# Altium project WK_核心底板_v1_20250228.PrjPcb (part 1 of 2)
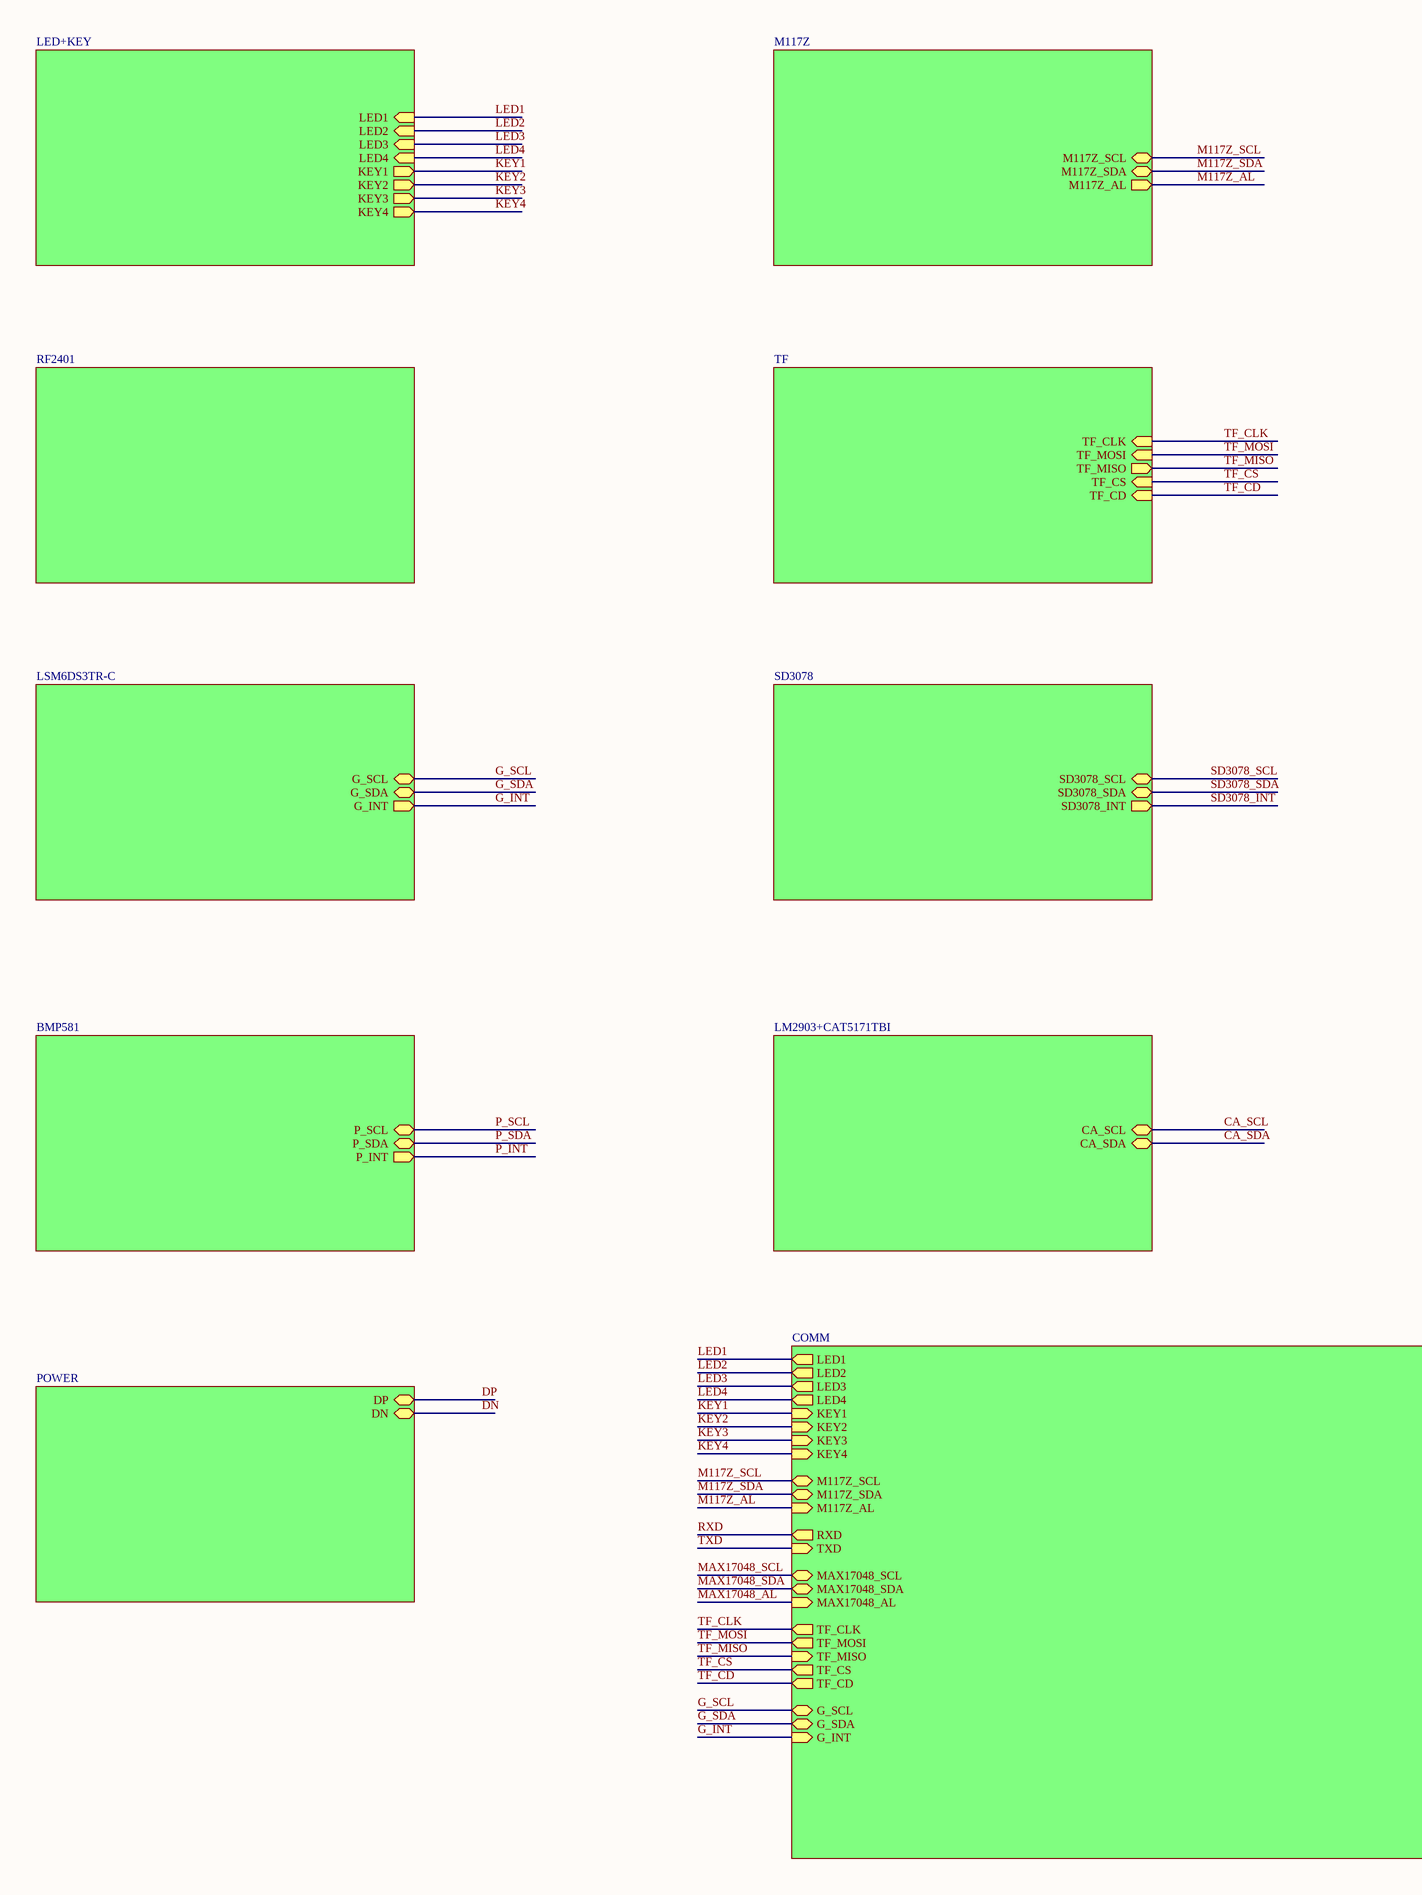
[diagram p0: COVER.SchDoc, left]
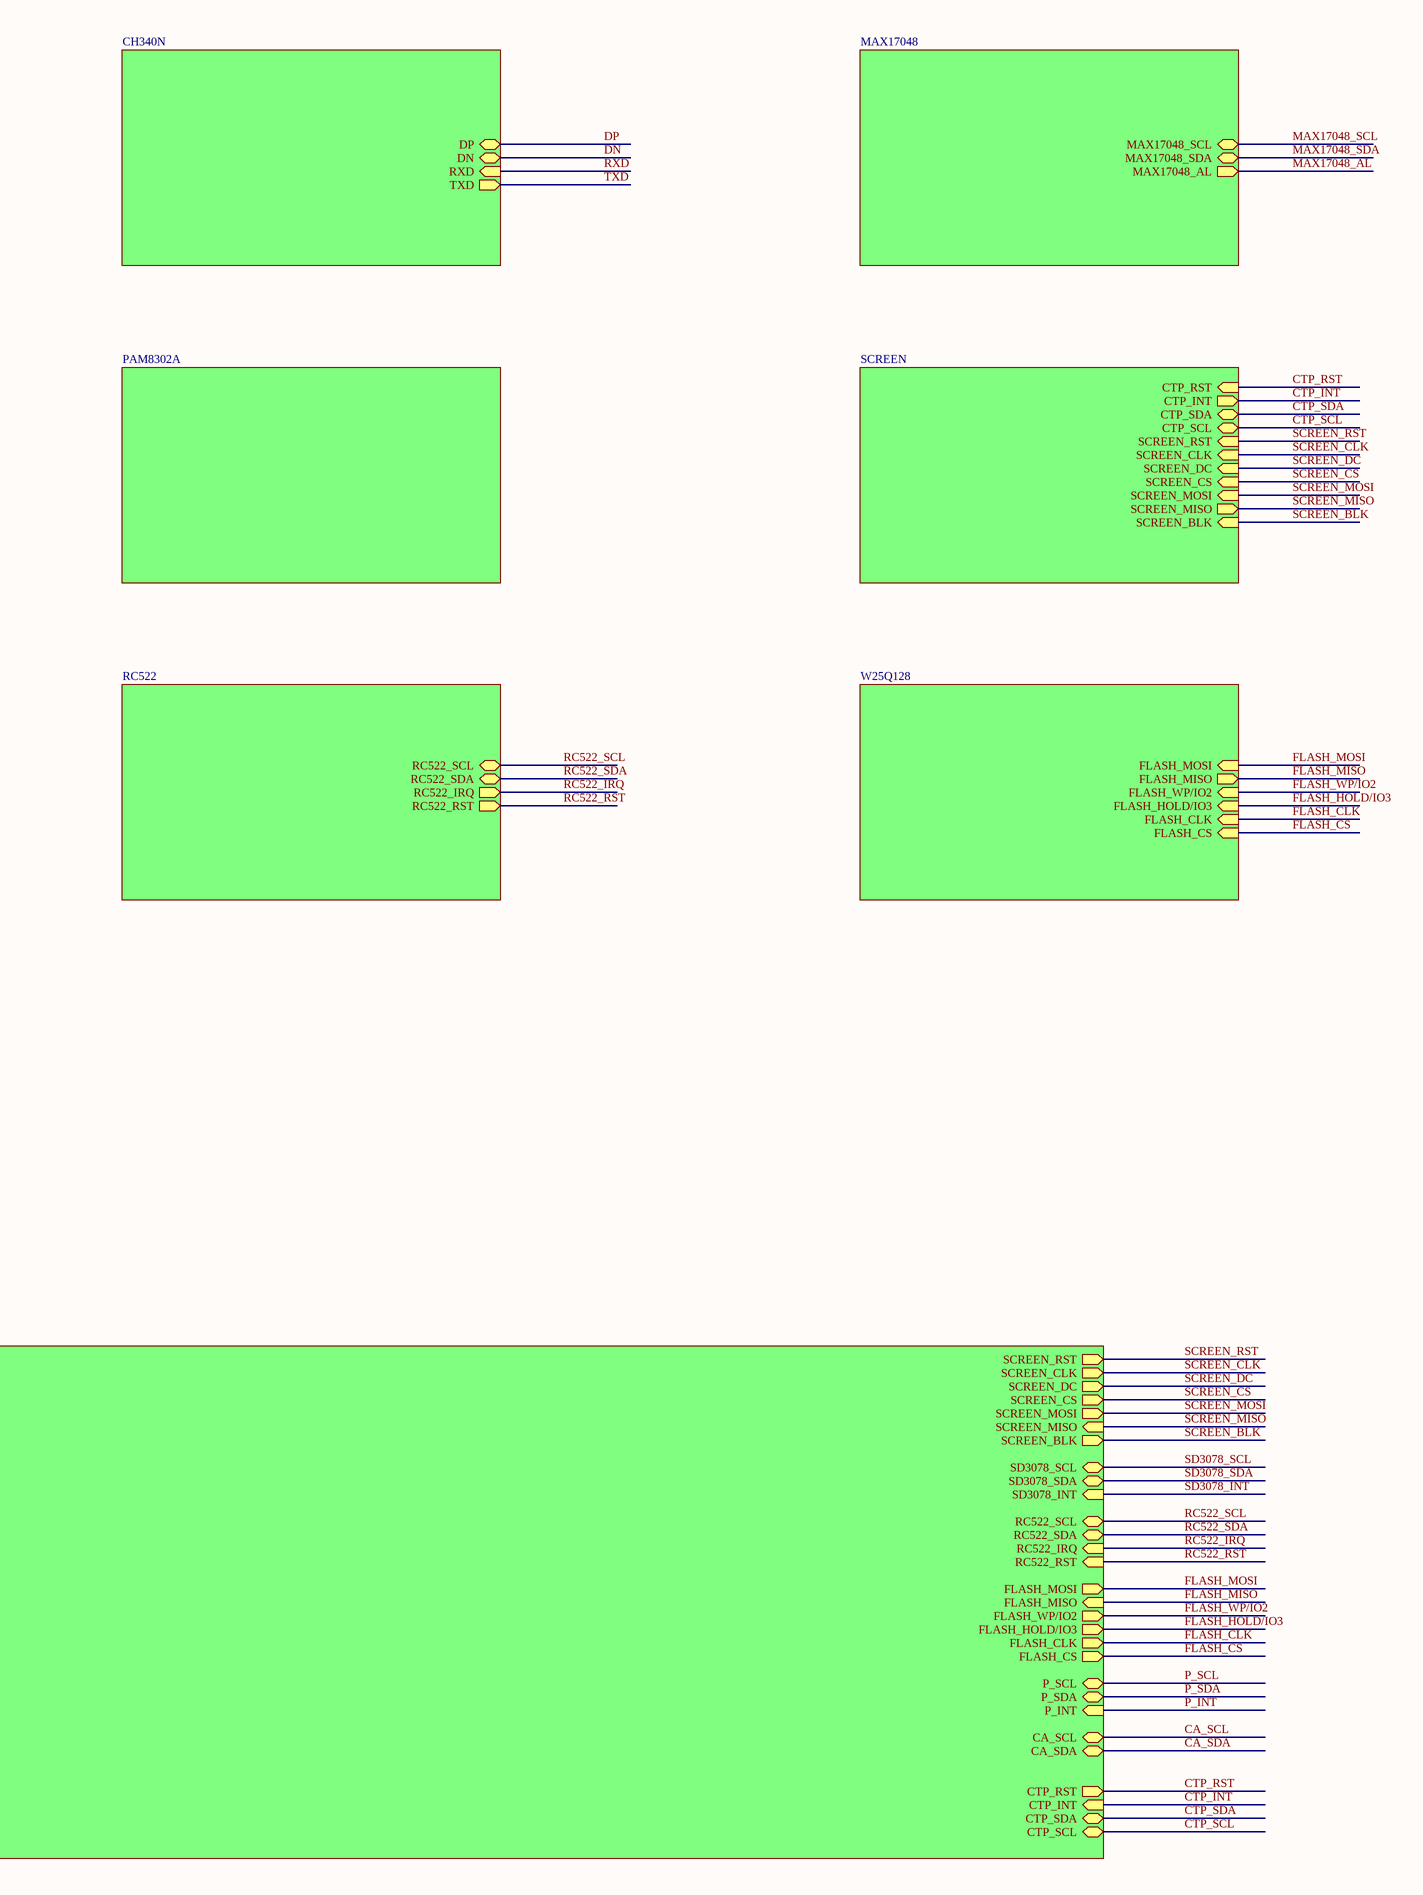
[diagram p1: COVER.SchDoc, right]
17 sheets, 291 parts. Net scope: hierarchical (ports join the sheet entries above them; power ports are global).
Board file: WK_TEST_V01_20250304.PcbDoc
Sheets:
  COVER.SchDoc
    LED+KEY = LED+KEY.SchDoc
    M117Z = M117Z.SchDoc
    CH340N = CH340N.SchDoc
    MAX17048 = MAX17048.SchDoc
    W25Q128 = W25Q128.SchDoc
    RF2401 = RF2401.SchDoc
    TF = TF.SchDoc
    PAM8302A = PAM8302A.SchDoc
    SCREEN = SCREEN.SchDoc
    BMP581 = BMP581.SchDoc
    LSM6DS3TR-C = LSM6DS3TR-C.SchDoc
    SD3078 = SD3078.SchDoc
    RC522 = RC522.SchDoc
    COMM = COMM.SchDoc
    POWER = POWER.SchDoc
    LM2903+CAT5171TBI = LM2903+CAT5171TBI.SchDoc

## Sheet COVER.SchDoc
size A2; SheetNumber: 1; SheetTotal: 17

### Sub-sheets
BMP581 = BMP581: P_SCL (bidir), P_SDA (bidir), P_INT (out)
CH340N = CH340N: DP (bidir), DN (bidir), RXD (in), TXD (out)
COMM = COMM: LED1 (out), LED2 (out), LED3 (out), LED4 (out), KEY1 (in), KEY2 (in), KEY3 (in), KEY4 (in), M117Z_SCL (bidir), M117Z_SDA (bidir), M117Z_AL (in), RXD (out), TXD (in), MAX17048_SCL (bidir), MAX17048_SDA (bidir), MAX17048_AL (in), TF_CLK (out), TF_MOSI (out), TF_MISO (in), TF_CS (out), TF_CD (out), SCREEN_RST (out), SCREEN_CLK (out), SCREEN_DC (out), SCREEN_CS (out), SCREEN_MOSI (out), SCREEN_MISO (in), SCREEN_BLK (out), G_SCL (bidir), G_SDA (bidir), G_INT (in), SD3078_SCL (bidir), SD3078_SDA (bidir), SD3078_INT (in), RC522_SCL (bidir), RC522_SDA (bidir), RC522_IRQ (in), RC522_RST (in), FLASH_MOSI (out), FLASH_MISO (in), FLASH_WP/IO2 (out), FLASH_HOLD/IO3 (out), FLASH_CLK (out), FLASH_CS (out), P_SCL (bidir), P_SDA (bidir), P_INT (in), CA_SCL (bidir), CA_SDA (bidir), CTP_RST (out), CTP_INT (in), CTP_SDA (bidir), CTP_SCL (bidir)
LED+KEY = LED+KEY: LED1 (in), LED2 (in), LED3 (in), LED4 (in), KEY1 (out), KEY2 (out), KEY3 (out), KEY4 (out)
LM2903+CAT5171TBI = LM2903+CAT5171TBI: CA_SCL (bidir), CA_SDA (bidir)
LSM6DS3TR-C = LSM6DS3TR-C: G_SCL (bidir), G_SDA (bidir), G_INT (out)
M117Z = M117Z: M117Z_SCL (bidir), M117Z_SDA (bidir), M117Z_AL (out)
MAX17048 = MAX17048: MAX17048_SCL (bidir), MAX17048_SDA (bidir), MAX17048_AL (out)
PAM8302A = PAM8302A: no entries
POWER = POWER: DP (bidir), DN (bidir)
RC522 = RC522: RC522_SCL (bidir), RC522_SDA (bidir), RC522_IRQ (out), RC522_RST (out)
RF2401 = RF2401: no entries
SCREEN = SCREEN: SCREEN_RST (in), SCREEN_CLK (in), SCREEN_DC (in), SCREEN_CS (in), SCREEN_MOSI (in), SCREEN_MISO (out), SCREEN_BLK (in), CTP_RST (in), CTP_INT (out), CTP_SDA (bidir), CTP_SCL (bidir)
SD3078 = SD3078: SD3078_SCL (bidir), SD3078_SDA (bidir), SD3078_INT (out)
TF = TF: TF_CLK (in), TF_MOSI (in), TF_MISO (out), TF_CS (in), TF_CD (in)
W25Q128 = W25Q128: FLASH_MOSI (in), FLASH_MISO (out), FLASH_WP/IO2 (in), FLASH_HOLD/IO3 (in), FLASH_CLK (in), FLASH_CS (in)

### Nets
CA_SCL: sheet COMM/CA_SCL, sheet LM2903+CAT5171TBI/CA_SCL
CA_SDA: sheet COMM/CA_SDA, sheet LM2903+CAT5171TBI/CA_SDA
CTP_INT: sheet SCREEN/CTP_INT, sheet COMM/CTP_INT
CTP_RST: sheet SCREEN/CTP_RST, sheet COMM/CTP_RST
CTP_SCL: sheet SCREEN/CTP_SCL, sheet COMM/CTP_SCL
CTP_SDA: sheet SCREEN/CTP_SDA, sheet COMM/CTP_SDA
DN: sheet CH340N/DN, sheet POWER/DN
DP: sheet CH340N/DP, sheet POWER/DP
FLASH_CLK: sheet W25Q128/FLASH_CLK, sheet COMM/FLASH_CLK
FLASH_CS: sheet W25Q128/FLASH_CS, sheet COMM/FLASH_CS
FLASH_HOLD/IO3: sheet W25Q128/FLASH_HOLD/IO3, sheet COMM/FLASH_HOLD/IO3
FLASH_MISO: sheet W25Q128/FLASH_MISO, sheet COMM/FLASH_MISO
FLASH_MOSI: sheet W25Q128/FLASH_MOSI, sheet COMM/FLASH_MOSI
FLASH_WP/IO2: sheet W25Q128/FLASH_WP/IO2, sheet COMM/FLASH_WP/IO2
G_INT: sheet LSM6DS3TR-C/G_INT, sheet COMM/G_INT
G_SCL: sheet LSM6DS3TR-C/G_SCL, sheet COMM/G_SCL
G_SDA: sheet LSM6DS3TR-C/G_SDA, sheet COMM/G_SDA
KEY1: sheet LED+KEY/KEY1, sheet COMM/KEY1
KEY2: sheet LED+KEY/KEY2, sheet COMM/KEY2
KEY3: sheet LED+KEY/KEY3, sheet COMM/KEY3
KEY4: sheet LED+KEY/KEY4, sheet COMM/KEY4
LED1: sheet LED+KEY/LED1, sheet COMM/LED1
LED2: sheet LED+KEY/LED2, sheet COMM/LED2
LED3: sheet LED+KEY/LED3, sheet COMM/LED3
LED4: sheet LED+KEY/LED4, sheet COMM/LED4
M117Z_AL: sheet M117Z/M117Z_AL, sheet COMM/M117Z_AL
M117Z_SCL: sheet M117Z/M117Z_SCL, sheet COMM/M117Z_SCL
M117Z_SDA: sheet M117Z/M117Z_SDA, sheet COMM/M117Z_SDA
MAX17048_AL: sheet MAX17048/MAX17048_AL, sheet COMM/MAX17048_AL
MAX17048_SCL: sheet MAX17048/MAX17048_SCL, sheet COMM/MAX17048_SCL
MAX17048_SDA: sheet MAX17048/MAX17048_SDA, sheet COMM/MAX17048_SDA
P_INT: sheet BMP581/P_INT, sheet COMM/P_INT
P_SCL: sheet BMP581/P_SCL, sheet COMM/P_SCL
P_SDA: sheet BMP581/P_SDA, sheet COMM/P_SDA
RC522_IRQ: sheet RC522/RC522_IRQ, sheet COMM/RC522_IRQ
RC522_RST: sheet RC522/RC522_RST, sheet COMM/RC522_RST
RC522_SCL: sheet RC522/RC522_SCL, sheet COMM/RC522_SCL
RC522_SDA: sheet RC522/RC522_SDA, sheet COMM/RC522_SDA
RXD: sheet CH340N/RXD, sheet COMM/RXD
SCREEN_BLK: sheet SCREEN/SCREEN_BLK, sheet COMM/SCREEN_BLK
SCREEN_CLK: sheet SCREEN/SCREEN_CLK, sheet COMM/SCREEN_CLK
SCREEN_CS: sheet SCREEN/SCREEN_CS, sheet COMM/SCREEN_CS
SCREEN_DC: sheet SCREEN/SCREEN_DC, sheet COMM/SCREEN_DC
SCREEN_MISO: sheet SCREEN/SCREEN_MISO, sheet COMM/SCREEN_MISO
SCREEN_MOSI: sheet SCREEN/SCREEN_MOSI, sheet COMM/SCREEN_MOSI
SCREEN_RST: sheet SCREEN/SCREEN_RST, sheet COMM/SCREEN_RST
SD3078_INT: sheet SD3078/SD3078_INT, sheet COMM/SD3078_INT
SD3078_SCL: sheet SD3078/SD3078_SCL, sheet COMM/SD3078_SCL
SD3078_SDA: sheet SD3078/SD3078_SDA, sheet COMM/SD3078_SDA
TF_CD: sheet TF/TF_CD, sheet COMM/TF_CD
TF_CLK: sheet TF/TF_CLK, sheet COMM/TF_CLK
TF_CS: sheet TF/TF_CS, sheet COMM/TF_CS
TF_MISO: sheet TF/TF_MISO, sheet COMM/TF_MISO
TF_MOSI: sheet TF/TF_MOSI, sheet COMM/TF_MOSI
TXD: sheet CH340N/TXD, sheet COMM/TXD

## Sheet LED+KEY.SchDoc
size A4; SheetNumber: 2; SheetTotal: 17
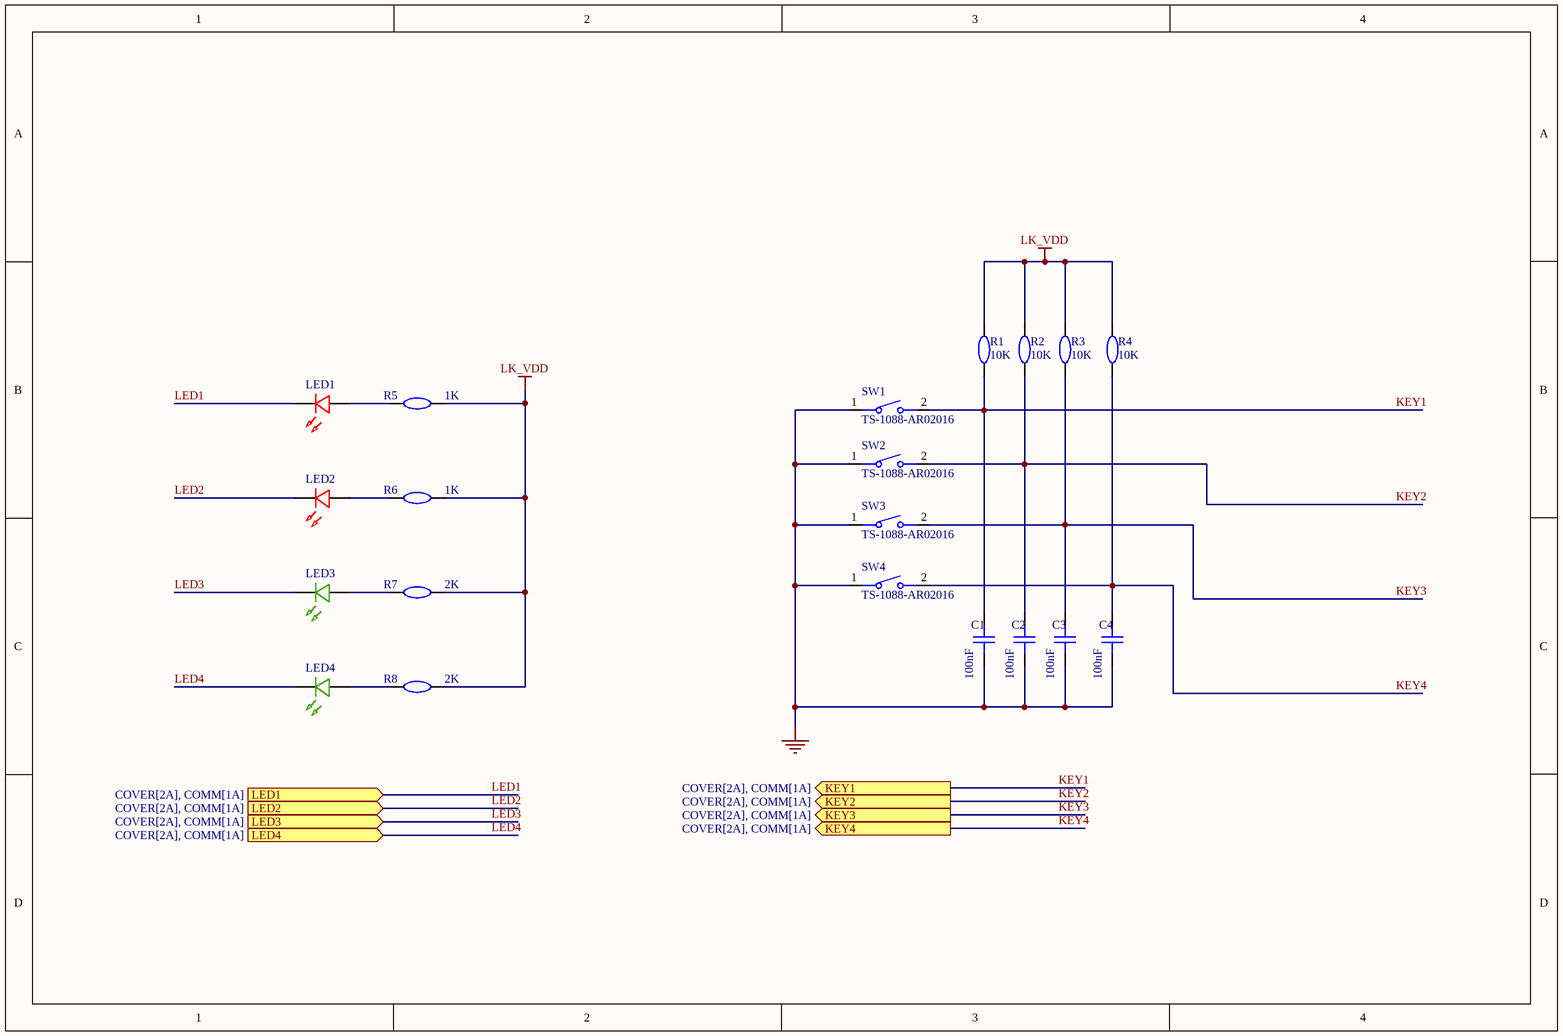
[diagram p2: LED+KEY.SchDoc]

### Parts
C1  100nF  [C0402]
C2  100nF  [C0402]
C3  100nF  [C0402]
C4  100nF  [C0402]
LED1  LED_0603-R  [LED_0603]  (value not drawn)
LED2  LED_0603-R  [LED_0603]  (value not drawn)
LED3  LED_0603-R  [LED_0603]  (value not drawn)
LED4  LED_0603-R  [LED_0603]  (value not drawn)
R1  10K  [R0402]
R2  10K  [R0402]
R3  10K  [R0402]
R4  10K  [R0402]
R5  1K  [R0402]
R6  1K  [R0402]
R7  2K  [R0402]
R8  2K  [R0402]
SW1  TS-1088-AR02016  [SW-SMD_L3.9-W3.0-P4.45]
SW2  TS-1088-AR02016  [SW-SMD_L3.9-W3.0-P4.45]
SW3  TS-1088-AR02016  [SW-SMD_L3.9-W3.0-P4.45]
SW4  TS-1088-AR02016  [SW-SMD_L3.9-W3.0-P4.45]

### Ports
KEY1 (out, see COVER[2A], COMM[1A]), KEY2 (out, see COVER[2A], COMM[1A]), KEY3 (out, see COVER[2A], COMM[1A]), KEY4 (out, see COVER[2A], COMM[1A]), LED1 (in, see COVER[2A], COMM[1A]), LED2 (in, see COVER[2A], COMM[1A]), LED3 (in, see COVER[2A], COMM[1A]), LED4 (in, see COVER[2A], COMM[1A])

### Nets
GND: C1.1 C2.1 C3.1 C4.1 SW1.1 SW2.1 SW3.1 SW4.1
LK_VDD: R1.2 R2.2 R3.2 R4.2 R5.1 R6.1 R7.1 R8.1
KEY1: C1.2 R1.1 SW1.2 ; port KEY1
KEY2: C2.2 R2.1 SW2.2 ; port KEY2
KEY3: C3.2 R3.1 SW3.2 ; port KEY3
KEY4: C4.2 R4.1 SW4.2 ; port KEY4
LED1: LED1.1(C) ; port LED1
LED2: LED2.1(C) ; port LED2
LED3: LED3.1(C) ; port LED3
LED4: LED4.1(C) ; port LED4
NetLED1_2: LED1.2(A) R5.2
NetLED2_2: LED2.2(A) R6.2
NetLED3_2: LED3.2(A) R7.2
NetLED4_2: LED4.2(A) R8.2

### Library data of the parts
C1-C4 = CAP_0402: Symbol: CapAcitance; Device: CAP_0603; Convert to PCB: yes; Add into BOM: yes; Supplier Footprint: 0603; Value: 100nF; Name: 100nF
LED1 LED2 = LED_0603-R: Symbol: LED_R; Convert to PCB: yes; Device: LED_0603-R; Add into BOM: yes; Supplier Footprint: 0603
LED3 LED4 = LED_0603-G: Symbol: LED_R; Convert to PCB: yes; Device: LED_0603-R; Add into BOM: yes; Supplier Footprint: 0603
R1-R8 = Res_0402: Symbol: 电阻; Device: Res_0603; Convert to PCB: yes; Add into BOM: yes; Supplier Footprint: 0603
  R1-R4: Value: 10K; Name: 10K
  R5 R6: Value: 1K; Name: 1K
  R7 R8: Value: 2K; Name: 2K
SW1-SW4 = TS-1088-AR02016: Manufacturer: XUNPU(讯普); Add into BOM: yes; Circuit: 单刀单掷; Actuator Style: 圆形按钮; Operating Force: 160gf; Switch Length: 4mm; Switch Width: 3mm; Switch Height: 2mm; Strike Gundam: 不带; Contact Current: 50mA; Voltage Rating (DC): 12V; Insulation Resistance: 100MΩ; Actuator/Cap Color: 黑色; Pin Style: SMD接片; Mechanical Life: 10万次; Symbol: TS-1088-AR02016; Device: TS-1088-AR02016; LCSC Part Name: 4*3*2mm 立贴 轻触开关; Supplier Part: C720477; Manufacturer Part: TS-1088-AR02016; Supplier Footprint: SMD; Datasheet: https://atta.szlcsc.com/upload/public/pdf/source/20200810/C720475_60D09DD6C54279ADDB2DC25100F1CC11.pdf; Supplier: LCSC; Convert to PCB: yes; Mounting Style: 立贴; Operating Temperature: -30℃~+80℃; Name: TS-1088-AR02016

## Sheet M117Z.SchDoc
size A4; SheetNumber: 3; SheetTotal: 17
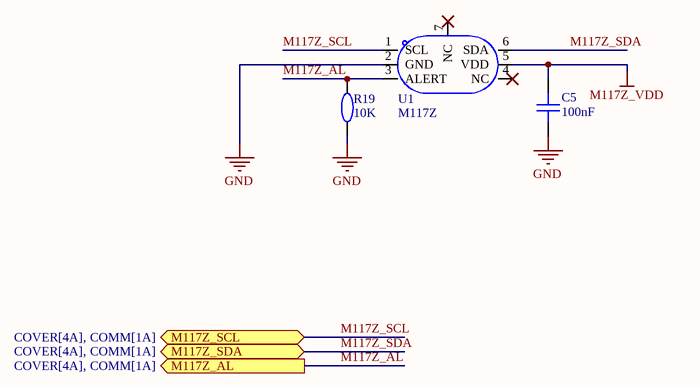
[diagram p3: M117Z.SchDoc]

### Parts
C5  100nF  [C0402]
R19  10K  [R0402]
U1  M117Z  [TDFN-6_L2.0-W2.0-P0.65-TL-EP1.4]

### Ports
M117Z_AL (out, see COVER[4A], COMM[1A]), M117Z_SCL (bidir, see COVER[4A], COMM[1A]), M117Z_SDA (bidir, see COVER[4A], COMM[1A])

### Nets
GND: C5.1 R19.1 U1.2(GND)
M117Z_VDD: C5.2 U1.5(VDD)
M117Z_AL: R19.2 U1.3(ALERT) ; port M117Z_AL
M117Z_SCL: U1.1(SCL) ; port M117Z_SCL
M117Z_SDA: U1.6(SDA) ; port M117Z_SDA

Not connected (* = marked no-connect by the designer): U1 4(NC)* 7(NC)*

### Library data of the parts
C5 = CAP_0402: as C1 on sheet LED+KEY; Add into BOM: yes; Supplier Footprint: 0603; Value: 100nF; Name: 100nF
R19 = Res_0402: as R1 on sheet LED+KEY; Add into BOM: yes; Supplier Footprint: 0603; Value: 10K; Name: 10K
U1 = M117Z: Manufacturer: Mysentech(敏源传感); Add into BOM: yes; Tolerance: ±0.1℃; Voltage - Supply: 1.8V~5.5V; Standby Current: 100nA; Interface: I2C; Symbol: M117Z; Device: M117Z; LCSC Part Name: 0.1℃ I2C数字温度传感器; Supplier Part: C3010933; Manufacturer Part: M117Z; Supplier Footprint: TDFN-6-EP(2x2); Datasheet: https://atta.szlcsc.com/upload/public/pdf/source/20210825/E4930D3FBCA70456AA9027E524284463.pdf; Supplier: LCSC; Convert to PCB: yes; Temperature Range: -70℃~+150℃; Name: M117Z

## Sheet CH340N.SchDoc
size A4; SheetNumber: 4; SheetTotal: 17
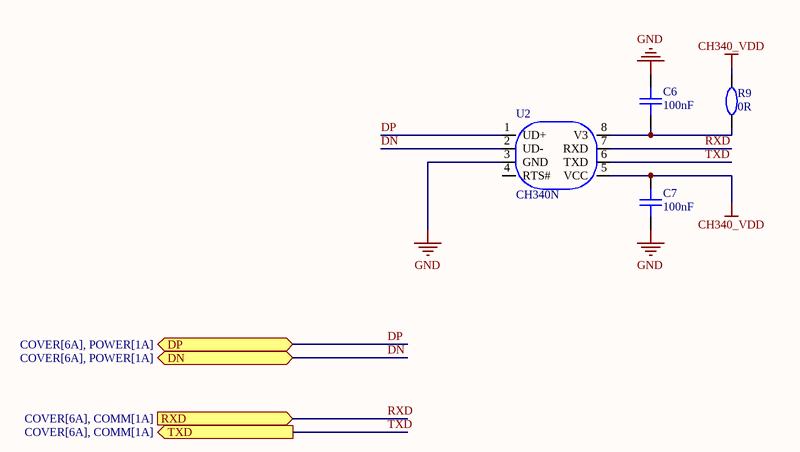
[diagram p4: CH340N.SchDoc]

### Parts
C6  100nF  [C0402]
C7  100nF  [C0402]
R9  0R  [R0402]
U2  CH340N  [SOP-8_L4.9-W3.9-P1.27-LS6.0-BL]

### Ports
DN (bidir, see COVER[6A], POWER[1A]), DP (bidir, see COVER[6A], POWER[1A]), RXD (in, see COVER[6A], COMM[1A]), TXD (out, see COVER[6A], COMM[1A])

### Nets
CH340_VDD: C7.2 R9.2 U2.5(VCC)
GND: C6.2 C7.1 U2.3(GND)
DN: U2.2(UD-) ; port DN
DP: U2.1(UD+) ; port DP
RXD: U2.7(RXD) ; port RXD
TXD: U2.6(TXD) ; port TXD
NetC6_1: C6.1 R9.1 U2.8(V3)

Not connected (* = marked no-connect by the designer): U2 4(RTS#)

### Library data of the parts
C6 C7 = CAP_0402: as C1 on sheet LED+KEY; Add into BOM: yes; Supplier Footprint: 0603; Value: 100nF; Name: 100nF
R9 = Res_0402: as R1 on sheet LED+KEY; Add into BOM: yes; Supplier Footprint: 0603; Value: 0R; Name: 0R
U2 = CH340N: Manufacturer: WCH(南京沁恒); Symbol: CH340N_C2977777; Add into BOM: yes; Applications Function: USB转串口; Protocol: USB 2.0; Number of Channels: 1; Voltage - Supply: 3.3V；5V; Data Rate: 2Mbps; Device: CH340N; LCSC Part Name: USB2.0芯片CH340; Supplier Part: C2977777; Manufacturer Part: CH340N; Supplier Footprint: SOP-8; Datasheet: https://atta.szlcsc.com/upload/public/pdf/source/20240313/115CDE92081B1D6CB446704AD5D0F5F2.pdf; Supplier: LCSC; Convert to PCB: yes; Operating Temperature: -20℃~+70℃; Name: CH340N

## Sheet MAX17048.SchDoc
size A4; SheetNumber: 5; SheetTotal: 17
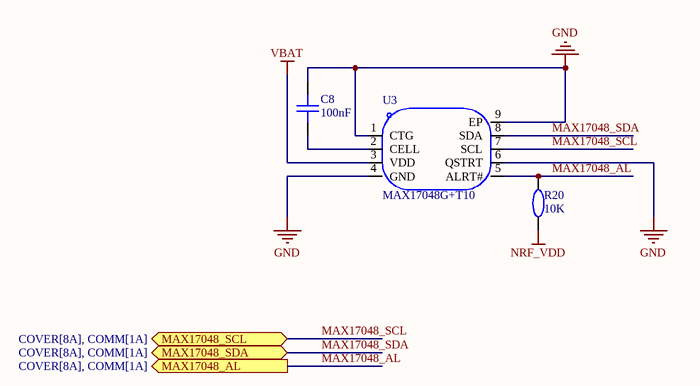
[diagram p5: MAX17048.SchDoc]

### Parts
C8  100nF  [C0402]
R20  10K  [R0402]
U3  MAX17048G+T10  [DFN-8_L2.0-W2.0-P0.50-BL-EP]

### Ports
MAX17048_AL (out, see COVER[8A], COMM[1A]), MAX17048_SCL (bidir, see COVER[8A], COMM[1A]), MAX17048_SDA (bidir, see COVER[8A], COMM[1A])

### Nets
GND: C8.2 U3.1(CTG) U3.4(GND) U3.6(QSTRT) U3.9(EP)
NRF_VDD: R20.1
VBAT: U3.3(VDD)
MAX17048_AL: R20.2 U3.5(ALRT#) ; port MAX17048_AL
MAX17048_SCL: U3.7(SCL) ; port MAX17048_SCL
MAX17048_SDA: U3.8(SDA) ; port MAX17048_SDA
NetC8_1: C8.1 U3.2(CELL)

### Library data of the parts
C8 = CAP_0402: as C1 on sheet LED+KEY; Add into BOM: yes; Supplier Footprint: 0603; Value: 100nF; Name: 100nF
R20 = Res_0402: as R1 on sheet LED+KEY; Add into BOM: yes; Supplier Footprint: 0603; Value: 10K; Name: 10K
U3 = MAX17048G+T10: Manufacturer: ADI(亚德诺)/MAXIM(美信); Add into BOM: yes; The Chip Type: 电池监测芯片; Type of Battery: 锂离子/聚合物; Number of Cells: 1; Symbol: MAX17048G+T10; Device: MAX17048G+T10; LCSC Part Name: MAX17048G+T10; Supplier Part: C2682616; Manufacturer Part: MAX17048G+T10; Supplier Footprint: DFN-8-EP(2x2); Datasheet: https://atta.szlcsc.com/upload/public/pdf/source/20210106/C2682616_818568B5D3BA4B627110FCAA33E0BFB1.pdf; Supplier: LCSC; Convert to PCB: yes; Operating Temperature: -20℃~+70℃; Name: MAX17048G+T10

## Sheet W25Q128.SchDoc
size A4; SheetNumber: 6; SheetTotal: 17
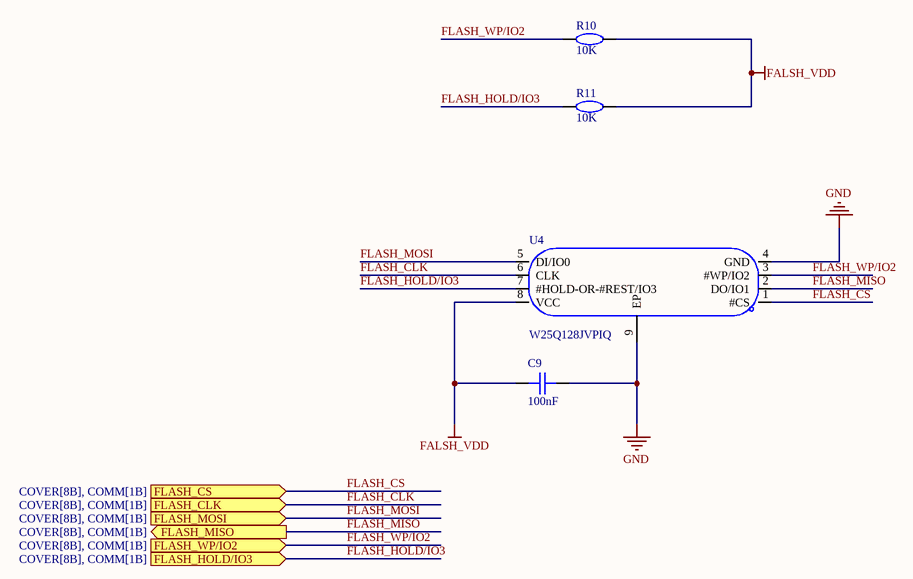
[diagram p6: W25Q128.SchDoc]

### Parts
C9  100nF  [C0402]
R10  10K  [R0402]
R11  10K  [R0402]
U4  W25Q128JVPIQ  [WSON-8_L6.0-W5.0-P1.27-BL-EP]

### Ports
FLASH_CLK (in, see COVER[8B], COMM[1B]), FLASH_CS (in, see COVER[8B], COMM[1B]), FLASH_HOLD/IO3 (in, see COVER[8B], COMM[1B]), FLASH_MISO (out, see COVER[8B], COMM[1B]), FLASH_MOSI (in, see COVER[8B], COMM[1B]), FLASH_WP/IO2 (in, see COVER[8B], COMM[1B])

### Nets
FALSH_VDD: C9.1 R10.2 R11.2 U4.8(VCC)
GND: C9.2 U4.4(GND) U4.9(EP)
FLASH_CLK: U4.6(CLK) ; port FLASH_CLK
FLASH_CS: U4.1(#CS) ; port FLASH_CS
FLASH_HOLD/IO3: R11.1 U4.7(#HOLD-OR-#REST/IO3) ; port FLASH_HOLD/IO3
FLASH_MISO: U4.2(DO/IO1) ; port FLASH_MISO
FLASH_MOSI: U4.5(DI/IO0) ; port FLASH_MOSI
FLASH_WP/IO2: R10.1 U4.3(#WP/IO2) ; port FLASH_WP/IO2

### Library data of the parts
C9 = CAP_0402: as C1 on sheet LED+KEY; Add into BOM: yes; Supplier Footprint: 0603; Value: 100nF; Name: 100nF
R10 R11 = Res_0402: as R1 on sheet LED+KEY; Add into BOM: yes; Supplier Footprint: 0603; Value: 10K; Name: 10K
U4 = W25Q128JVPIQ_C190862: Manufacturer: WINBOND(华邦); Symbol: W25Q128JVPIQTR; Add into BOM: yes; Memory Size: 128Mbit; Device: W25Q128JVPIQ_C190862; LCSC Part Name: W25Q128JVPIQ; Supplier Part: C190862; Manufacturer Part: W25Q128JVPIQ; Supplier Footprint: WSON-8-EP(5x6); Datasheet: https://atta.szlcsc.com/upload/public/pdf/source/20190705/C401662_06B6D416F67ED315879B366F63A3F7C9.pdf; Supplier: LCSC; Convert to PCB: yes; Name: W25Q128JVPIQ

## Sheet RF2401.SchDoc
size A3; SheetNumber: 7; SheetTotal: 17
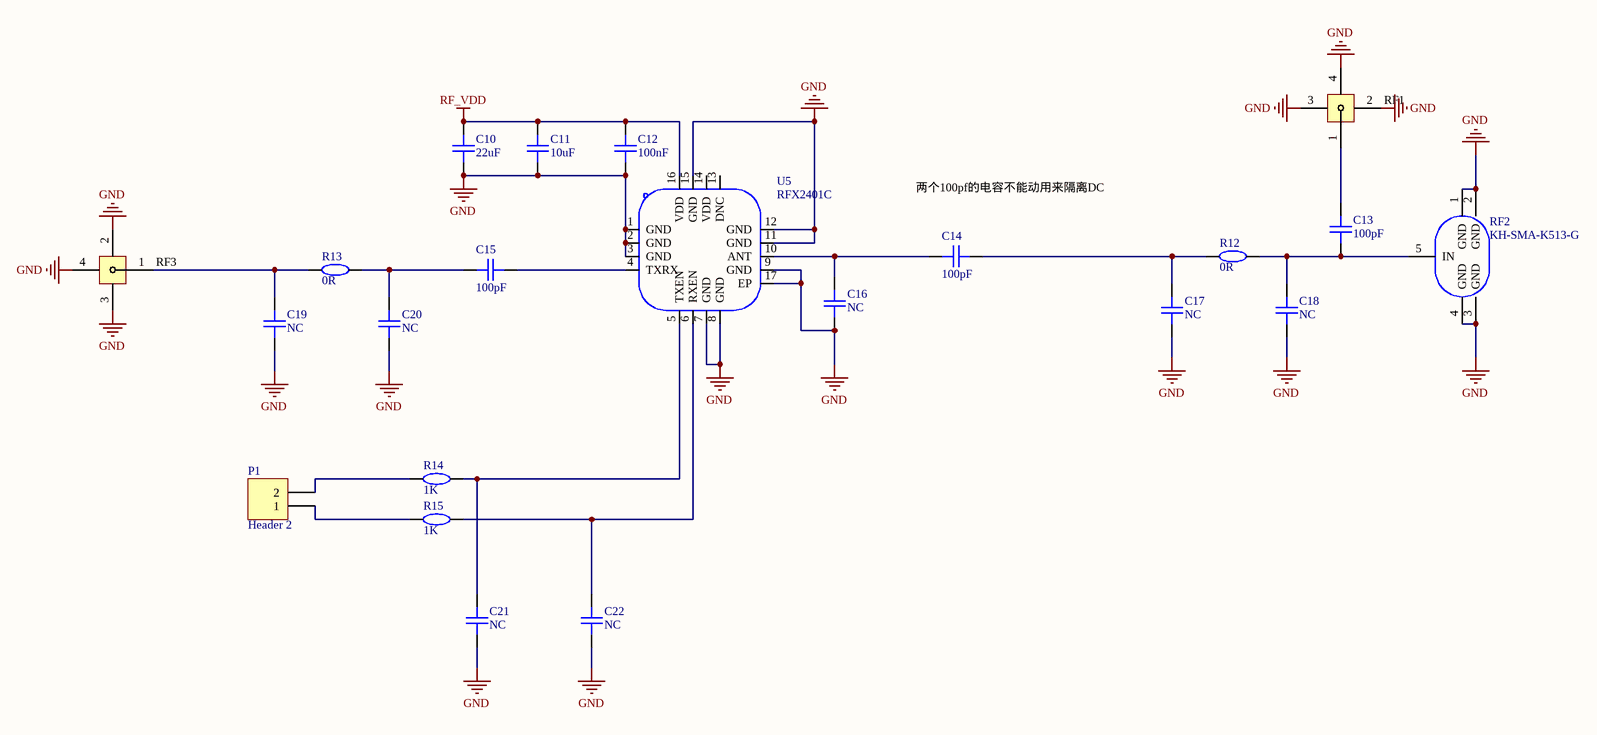
[diagram p7: RF2401.SchDoc]

### Parts
C10  22uF  [C0603]
C11  10uF  [C0603]
C12  100nF  [C0402]
C13  100pF  [C0402]
C14  100pF  [C0402]
C15  100pF  [C0402]
C16  NC  [C0402]
C17  NC  [C0402]
C18  NC  [C0402]
C19  NC  [C0402]
C20  NC  [C0402]
C21  NC  [C0402]
C22  NC  [C0402]
P1  Header 2  [HDR1X2]
R12  0R  [R0402]
R13  0R  [R0402]
R14  1K  [R0402]
R15  1K  [R0402]
RF1  BWIPX-4-001E  [IPEX-SMD_BWIPX-4-001E]  (value not drawn)
RF2  KH-SMA-K513-G  [ANT-TH_KH-SMA-K513-G]
RF3  BWIPX-4-001E  [IPEX-SMD_BWIPX-4-001E]  (value not drawn)
U5  RFX2401C  [QFN-16_L3.0-W3.0-P0.50-BL-EP1.7]

### Nets
GND: C10.1 C11.1 C12.1 C16.2 C17.2 C18.2 C19.2 C20.2 C21.2 C22.2 RF1.2 RF1.3 RF1.4 RF2.1(GND) RF2.2(GND) RF2.3(GND) RF2.4(GND) RF3.2 RF3.3 RF3.4 U5.1(GND) U5.2(GND) U5.3(GND) U5.7(GND) U5.8(GND) U5.9(GND) U5.11(GND) U5.12(GND) U5.15(GND) U5.17(EP)
RF_VDD: C10.2 C11.2 C12.2 U5.16(VDD)
NetC13_1: C13.1 RF1.1
NetC13_2: C13.2 C18.1 R12.2 RF2.5(IN)
NetC14_1: C14.1 C17.1 R12.1
NetC14_2: C14.2 C16.1 U5.10(ANT)
NetC15_1: C15.1 U5.4(TXRX)
NetC15_2: C15.2 C20.1 R13.2
NetC19_1: C19.1 R13.1 RF3.1
NetC21_1: C21.1 R14.2 U5.5(TXEN)
NetC22_1: C22.1 R15.2 U5.6(RXEN)
NetP1_1: P1.1 R15.1
NetP1_2: P1.2 R14.1

Not connected (* = marked no-connect by the designer): U5 13(DNC) 14(VDD)

### Notes on the sheet
- 两个100pf的电容不能动用来隔离DC

### Library data of the parts
C10 C11 = CAP_0603: Symbol: CapAcitance; Convert to PCB: yes; Device: CAP_0603; Add into BOM: yes; Supplier Footprint: 0603
  C10: Value: 22uF; Name: 22uF
  C11: Value: 10uF; Name: 10uF
C12-C22 = CAP_0402: as C1 on sheet LED+KEY; Add into BOM: yes; Supplier Footprint: 0603
  C12: Value: 100nF; Name: 100nF
  C13-C15: Value: 100pF; Name: 100pF
  C16-C22: Value: NC; Name: NC
P1 = Header 2: Header, 2-Pin; LatestRevisionDate: 17-Jul-2002; LatestRevisionNote: Re-released for DXP Platform.; Publisher: Altium Limited
R12-R15 = Res_0402: as R1 on sheet LED+KEY; Add into BOM: yes; Supplier Footprint: 0603
  R12 R13: Value: 0R; Name: 0R
  R14 R15: Value: 1K; Name: 1K
RF1 RF3 = BWIPX-4-001E: C784401; Manufacturer: BAT WIRELESS(蝙蝠无线); Add into BOM: yes; Connector Type: 板端; Interface Type: 内针; Interface Diameter: 1.5mm; RF Series: IPEX; Number of Ports: 1; Name: BWIPX-4-001E; Symbol: BWIPX-4-001E; Device: BWIPX-4-001E; LCSC Part Name: IPEX 内针 四代板端 IPEX4座子; Supplier Part: C784401; Manufacturer Part: BWIPX-4-001E; Supplier Footprint: SMD; JLCPCB Part Class: Extended Part; Datasheet: https://atta.szlcsc.com/upload/public/pdf/source/20200915/C784401_F782AD355A18B33ABEEDBC6CC33688E9.pdf; Supplier: LCSC; Convert to PCB: yes; Frequency-Max: -; Impedance: -; Style: -; Interface Length/Height: -; Operating Temperature Range: -
RF2 = KH-SMA-K513-G: Manufacturer: kinghelm(金航标); Add into BOM: yes; Connector Type: 板端; Interface Type: 内孔; Number of Ports: 1; Frequency-Max: 6GHz; RF Series: SMA; Impedance: 50Ω; Style: 弯头; Symbol: KH-SMA-K513-G; Device: KH-SMA-K513-G; LCSC Part Name: SMA 内孔 弯头; Supplier Part: C411575; Manufacturer Part: KH-SMA-K513-G; Supplier Footprint: 插件; JLCPCB Part Class: 扩展库; Datasheet: https://atta.szlcsc.com/upload/public/pdf/source/20210317/C411575_49039CD64129040639EC5218E5A2C783.pdf; Supplier: LCSC; Convert to PCB: yes; Interface Diameter: -; Interface Length/Height: -; Operating Temperature Range: -55℃~+155℃; Name: KH-SMA-K513-G
U5 = RFX2401C: Manufacturer: SKYWORKS; Add into BOM: yes; Frequency Range: 2.4GHz~2.5GHz; Symbol: RFX2401C; Device: RFX2401C; LCSC Part Name: 2.4GHz ZIGBEE/ISM发送/接收射频前端集成电路; Supplier Part: C19213; Manufacturer Part: RFX2401C; Supplier Footprint: QFN-16-EP(3x3); JLCPCB Part Class: 扩展库; Datasheet: https://atta.szlcsc.com/upload/public/pdf/source/20130922/1457706649469.pdf; Supplier: LCSC; Convert to PCB: yes; Applications: 802.15.4,Zigbee; Name: RFX2401C

## Sheet TF.SchDoc
size A4; SheetNumber: 8; SheetTotal: 17
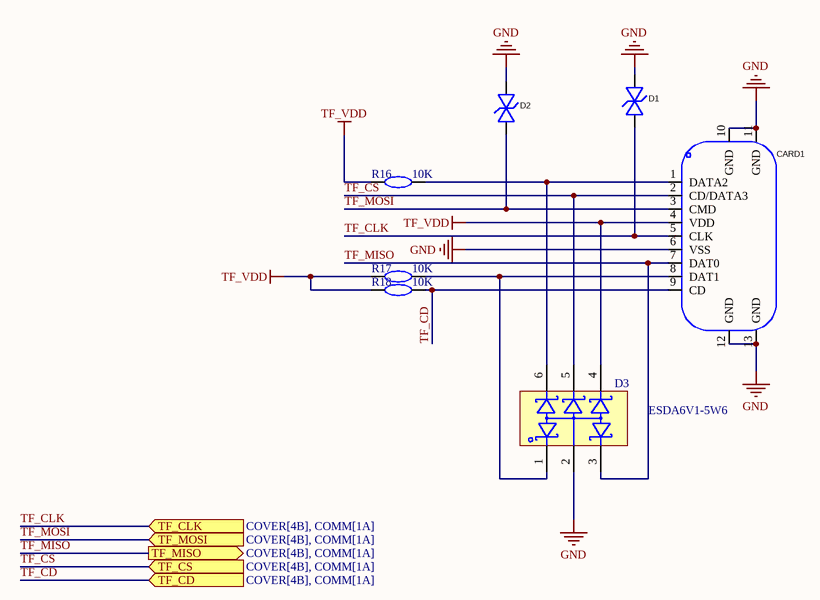
[diagram p8: TF.SchDoc]

### Parts
CARD1  TF-115-BCP9  [TF-SMD_TF-115-BCP9]  (value not drawn)
D1  DESD3V3S1BL-7B  [X1-DFN1006-2_L1.0-W0.6-BI]  (value not drawn)
D2  DESD3V3S1BL-7B  [X1-DFN1006-2_L1.0-W0.6-BI]  (value not drawn)
D3  ESDA6V1-5W6  [SOT323-6L_L2.0-W1.3-LS2.1-BR]
R16  10K  [R0402]
R17  10K  [R0402]
R18  10K  [R0402]

### Ports
TF_CD (in, see COVER[4B], COMM[1A]), TF_CLK (in, see COVER[4B], COMM[1A]), TF_CS (in, see COVER[4B], COMM[1A]), TF_MISO (out, see COVER[4B], COMM[1A]), TF_MOSI (in, see COVER[4B], COMM[1A])

### Nets
GND: CARD1.6(VSS) CARD1.10(GND) CARD1.11(GND) CARD1.12(GND) CARD1.13(GND) D1.2 D2.2 D3.2
TF_VDD: CARD1.4(VDD) D3.4 R16.1 R17.1 R18.1
TF_CD: CARD1.9(CD) R18.2 ; port TF_CD
TF_CLK: CARD1.5(CLK) D1.1 ; port TF_CLK
TF_CS: CARD1.2(CD/DATA3) D3.5 ; port TF_CS
TF_MISO: CARD1.7(DAT0) D3.3 ; port TF_MISO
TF_MOSI: CARD1.3(CMD) D2.1 ; port TF_MOSI
NetCARD1_1: CARD1.1(DATA2) D3.6 R16.2
NetCARD1_8: CARD1.8(DAT1) D3.1 R17.2

### Library data of the parts
CARD1 = TF-115-BCP9: Manufacturer: XUNPU(讯普); Add into BOM: yes; Card Connection Mode: 自弹式; Card Type: MicroSD卡(TF卡); Connector Type: 卡座; Maximum Body Height: 1.8mm; Soldering Temperature(Max): 260℃; Symbol: TF-115-BCP9; Device: TF-115-BCP9; LCSC Part Name: 自弹式 MicroSD卡(TF卡) 卡座; Supplier Part: C720505; Manufacturer Part: TF-115-BCP9; Supplier Footprint: SMD; JLCPCB Part Class: Extended Part; Datasheet: https://atta.szlcsc.com/upload/public/pdf/source/20210906/DBEC8F03AA1503572333C7CF4A76D0AD.pdf; Supplier: LCSC; Convert to PCB: yes; Contact Material: 磷铜; Contact Plating: 锡; Operating Temperature Range: -25℃~+85℃
D1 D2 = DESD3V3S1BL-7B: Manufacturer: DIODES(美台); Add into BOM: yes; Reverse Stand-Off Voltage (Vrwm): 3.3V@Max; Maximum Clamping Voltage: 7V; Peak Pulse Current (Ipp)@10/1000us: 5A@8/20us; Peak Pulse Power Dissipation (Ppp)@10/1000us: 35W; Breakdown Voltage: 3.8V; Type: TVS; Symbol: DESD3V3S1BL-7B; Device: DESD3V3S1BL-7B; LCSC Part Name: DESD3V3S1BL-7B; Supplier Part: C500765; Manufacturer Part: DESD3V3S1BL-7B; Supplier Footprint: X1-DFN1006-2; JLCPCB Part Class: Extended Part; Datasheet: https://atta.szlcsc.com/upload/public/pdf/source/20200324/C500765_A188D09536B76D3DE18AC7040917D9B9.pdf; Supplier: LCSC; Convert to PCB: yes
D3 = ESDA6V1-5W6: C87908; Manufacturer: ST(意法半导体); Symbol: ESDA6V1-5W6_C87908; Add into BOM: yes; Name: ESDA6V1-5W6; Device: ESDA6V1-5W6; LCSC Part Name: ESDA6V1-5W6; Supplier Part: C87908; Manufacturer Part: ESDA6V1-5W6; Supplier Footprint: SOT-323-6L; JLCPCB Part Class: Extended Part; Datasheet: https://atta.szlcsc.com/upload/public/pdf/source/20181012/C87908_152F6E511283D805F586217F4267C685.pdf; Supplier: LCSC; Convert to PCB: yes
R16-R18 = Res_0402: as R1 on sheet LED+KEY; Add into BOM: yes; Supplier Footprint: 0603; Value: 10K; Name: 10K

## Sheet PAM8302A.SchDoc
size A4; SheetNumber: 9; SheetTotal: 17
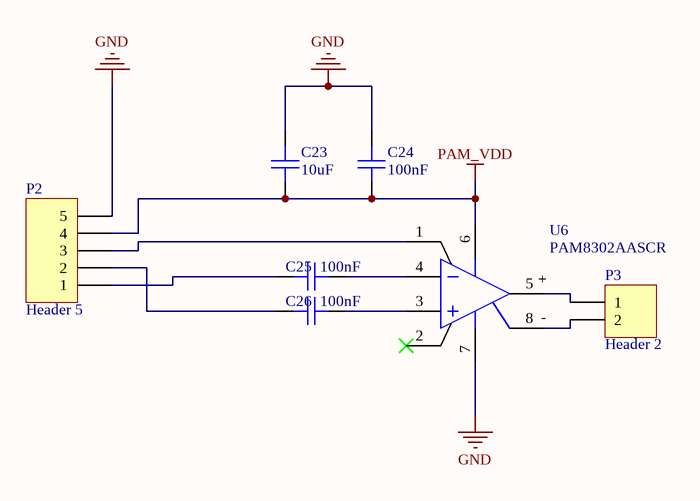
[diagram p9: PAM8302A.SchDoc]

### Parts
C23  10uF  [C0603]
C24  100nF  [C0402]
C25  100nF  [C0402]
C26  100nF  [C0402]
P2  Header 5  [HDR1X5]
P3  Header 2  [HDR1X2]
U6  PAM8302AASCR  [MSOP-8_L3.0-W3.0-P0.65-LS5.0-BL]

### Nets
GND: C23.2 C24.2 P2.5 U6.7(GND)
PAM_VDD: C23.1 C24.1 P2.4 U6.6(VDD)
NetC25_1: C25.1 U6.4(IN-)
NetC25_2: C25.2 P2.1
NetC26_1: C26.1 U6.3(IN+)
NetC26_2: C26.2 P2.2
NetP2_3: P2.3 U6.1(SD#)
NetP3_1: P3.1 U6.5(VO+)
NetP3_2: P3.2 U6.8(VO-)

Not connected (* = marked no-connect by the designer): U6 2(NC)*

### Notes on the sheet
- (in symbol PAM8302AASCR) +; -

### Library data of the parts
C23 = CAP_0603: Symbol: CapAcitance; Convert to PCB: yes; Device: CAP_0603; Add into BOM: yes; Supplier Footprint: 0603; Value: 10uF; Name: 10uF
C24-C26 = CAP_0402: as C1 on sheet LED+KEY; Add into BOM: yes; Supplier Footprint: 0603; Value: 100nF; Name: 100nF
P2 = Header 5: Header, 5-Pin; LatestRevisionDate: 17-Jul-2002; LatestRevisionNote: Re-released for DXP Platform.; Publisher: Altium Limited
P3 = Header 2: Header, 2-Pin; LatestRevisionDate: 17-Jul-2002; LatestRevisionNote: Re-released for DXP Platform.; Publisher: Altium Limited
U6 = PAM8302AASCR: Manufacturer: DIODES(美台); Add into BOM: yes; Type of Power Amplifier: D类功放; Speaker Channels: 单声道; Output Power: 2.5Wx1@4Ω; Supply Voltage: 2V~5.5V; Symbol: PAM8302AASCR; Device: PAM8302AASCR; LCSC Part Name: 2.5W单声道D类音频功率放大器; Supplier Part: C113367; Manufacturer Part: PAM8302AASCR; Supplier Footprint: MSOP-8; Datasheet: https://atta.szlcsc.com/upload/public/pdf/source/20170606/1496716410034.pdf; Supplier: LCSC; Convert to PCB: yes; Operating Temperature: -40℃~+85℃; Name: PAM8302AASCR

## Sheet SCREEN.SchDoc
size A3; SheetNumber: 10; SheetTotal: 17
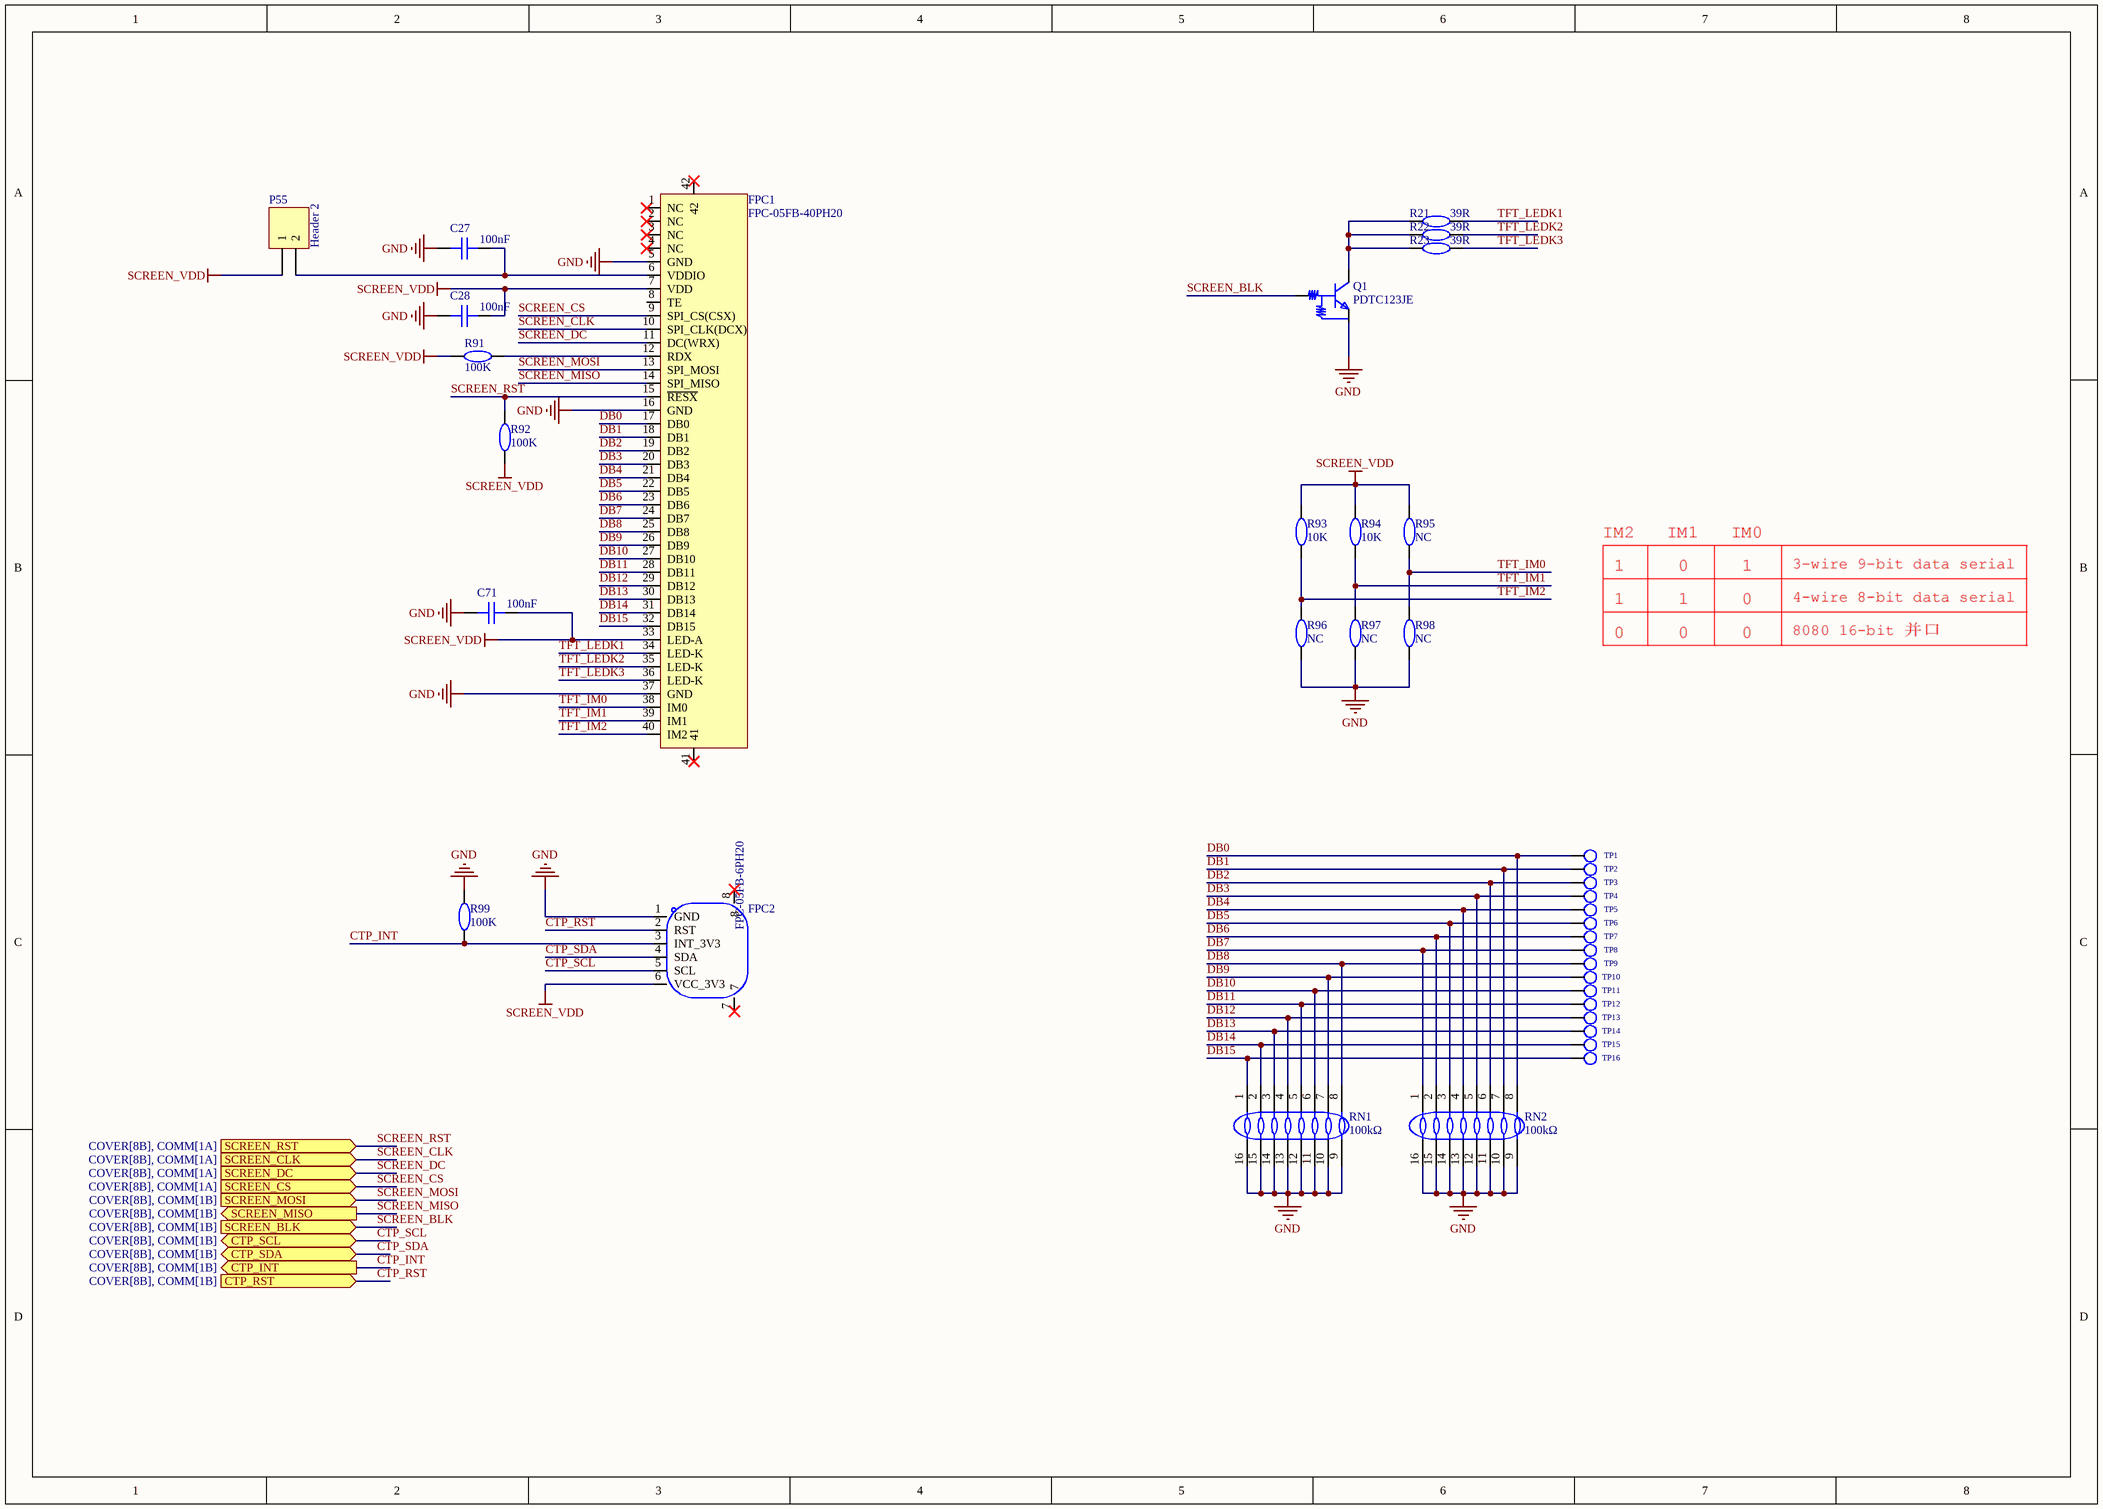
[diagram p10: SCREEN.SchDoc]

### Parts
C27  100nF  [C0402]
C28  100nF  [C0402]
C71  100nF  [C0402]
FPC1  FPC-05FB-40PH20  [FPC-SMD_40P-P0.50_XUNPU_FPC-05FB-40PH20]
FPC2  FPC-05FB-6PH20  [FPC-SMD_6P-P0.50_FPC-05FB-6PH20]
P55  Header 2  [HDR1X2]
Q1  PDTC123JE  [SOT-523_L1.6-W0.8-P1.00-LS1.6-BR]
R21  39R  [R0402]
R22  39R  [R0402]
R23  39R  [R0402]
R91  100K  [R0402]
R92  100K  [R0402]
R93  10K  [R0603]
R94  10K  [R0603]
R95  NC  [R0603]
R96  NC  [R0603]
R97  NC  [R0603]
R98  NC  [R0603]
R99  100K  [R0402]
RN1  100kΩ  [RES-ARRAY-SMD_16P-L3.8-W1.6-P0.50-BL]
RN2  100kΩ  [RES-ARRAY-SMD_16P-L3.8-W1.6-P0.50-BL]
TP1  T-SMD  [PAD_1.0_SMT]  (value not drawn)
TP2  T-SMD  [PAD_1.0_SMT]  (value not drawn)
TP3  T-SMD  [PAD_1.0_SMT]  (value not drawn)
TP4  T-SMD  [PAD_1.0_SMT]  (value not drawn)
TP5  T-SMD  [PAD_1.0_SMT]  (value not drawn)
TP6  T-SMD  [PAD_1.0_SMT]  (value not drawn)
TP7  T-SMD  [PAD_1.0_SMT]  (value not drawn)
TP8  T-SMD  [PAD_1.0_SMT]  (value not drawn)
TP9  T-SMD  [PAD_1.0_SMT]  (value not drawn)
TP10  T-SMD  [PAD_1.0_SMT]  (value not drawn)
TP11  T-SMD  [PAD_1.0_SMT]  (value not drawn)
TP12  T-SMD  [PAD_1.0_SMT]  (value not drawn)
TP13  T-SMD  [PAD_1.0_SMT]  (value not drawn)
TP14  T-SMD  [PAD_1.0_SMT]  (value not drawn)
TP15  T-SMD  [PAD_1.0_SMT]  (value not drawn)
TP16  T-SMD  [PAD_1.0_SMT]  (value not drawn)

### Ports
CTP_INT (out, see COVER[8B], COMM[1B]), CTP_RST (in, see COVER[8B], COMM[1B]), CTP_SCL (bidir, see COVER[8B], COMM[1B]), CTP_SDA (bidir, see COVER[8B], COMM[1B]), SCREEN_BLK (in, see COVER[8B], COMM[1B]), SCREEN_CLK (in, see COVER[8B], COMM[1A]), SCREEN_CS (in, see COVER[8B], COMM[1A]), SCREEN_DC (in, see COVER[8B], COMM[1A]), SCREEN_MISO (out, see COVER[8B], COMM[1B]), SCREEN_MOSI (in, see COVER[8B], COMM[1B]), SCREEN_RST (in, see COVER[8B], COMM[1A])

### Nets
GND: C27.1 C28.1 C71.1 FPC1.5(GND) FPC1.16(GND) FPC1.37(GND) FPC2.1(GND) Q1.2(GND) R96.1 R97.1 R98.1 R99.1 RN1.9 RN1.10 RN1.11 RN1.12 RN1.13 RN1.14 RN1.15 RN1.16 RN2.9 RN2.10 RN2.11 RN2.12 RN2.13 RN2.14 RN2.15 RN2.16
SCREEN_VDD: C28.2 C71.2 FPC1.7(VDD) FPC1.33(LED-A) FPC2.6(VCC_3V3) P55.1 R91.1 R92.1 R93.2 R94.2 R95.2
CTP_INT: FPC2.3(INT_3V3) R99.2 ; port CTP_INT
CTP_RST: FPC2.2(RST) ; port CTP_RST
CTP_SCL: FPC2.5(SCL) ; port CTP_SCL
CTP_SDA: FPC2.4(SDA) ; port CTP_SDA
DB0: FPC1.17(DB0) RN2.8 TP1.1
DB1: FPC1.18(DB1) RN2.7 TP2.1
DB2: FPC1.19(DB2) RN2.6 TP3.1
DB3: FPC1.20(DB3) RN2.5 TP4.1
DB4: FPC1.21(DB4) RN2.4 TP5.1
DB5: FPC1.22(DB5) RN2.3 TP6.1
DB6: FPC1.23(DB6) RN2.2 TP7.1
DB7: FPC1.24(DB7) RN2.1 TP8.1
DB8: FPC1.25(DB8) RN1.8 TP9.1
DB9: FPC1.26(DB9) RN1.7 TP10.1
DB10: FPC1.27(DB10) RN1.6 TP11.1
DB11: FPC1.28(DB11) RN1.5 TP12.1
DB12: FPC1.29(DB12) RN1.4 TP13.1
DB13: FPC1.30(DB13) RN1.3 TP14.1
DB14: FPC1.31(DB14) RN1.2 TP15.1
DB15: FPC1.32(DB15) RN1.1 TP16.1
SCREEN_BLK: Q1.1(IN) ; port SCREEN_BLK
SCREEN_CLK: FPC1.10(SPI_CLK(DCX)) ; port SCREEN_CLK
SCREEN_CS: FPC1.9(SPI_CS(CSX)) ; port SCREEN_CS
SCREEN_DC: FPC1.11(DC(WRX)) ; port SCREEN_DC
SCREEN_MISO: FPC1.14(SPI_MISO) ; port SCREEN_MISO
SCREEN_MOSI: FPC1.13(SPI_MOSI) ; port SCREEN_MOSI
SCREEN_RST: FPC1.15(~{RESX}) R92.2 ; port SCREEN_RST
TFT_IM0: FPC1.38(IM0) R95.1 R98.2
TFT_IM1: FPC1.39(IM1) R94.1 R97.2
TFT_IM2: FPC1.40(IM2) R93.1 R96.2
TFT_LEDK1: FPC1.34(LED-K) R21.2
TFT_LEDK2: FPC1.35(LED-K) R22.2
TFT_LEDK3: FPC1.36(LED-K) R23.2
NetC27_2: C27.2 FPC1.6(VDDIO) P55.2
NetFPC1_12: FPC1.12(RDX) R91.2
NetQ1_3: Q1.3(OUT) R21.1 R22.1 R23.1

Not connected (* = marked no-connect by the designer): FPC1 1(NC)* 2(NC)* 3(NC)* 4(NC)* 8(TE) 41* 42*; FPC2 7* 8*

### Library data of the parts
C27 C28 C71 = CAP_0402: as C1 on sheet LED+KEY; Add into BOM: yes; Supplier Footprint: 0603; Value: 100nF; Name: 100nF
FPC1 = 3.2TFT_FPC-05FB-40PH20: Manufacturer: XUNPU(讯普); Add into BOM: yes; Locking Feature: 翻盖式; Number of Contacts: 40P; Pitch: 0.5mm; FFC, FCB Thickness: 0.3mm; Symbol: FPC-05FB-40PH20; Device: FPC-05FB-40PH20; LCSC Part Name: 间距:0.5mm P数:40P 翻盖式 双侧触点/上下接; Supplier Part: C2856837; Manufacturer Part: FPC-05FB-40PH20; Supplier Footprint: SMD,P=0.5mm,卧贴; JLCPCB Part Class: 扩展库; Datasheet: https://atta.szlcsc.com/upload/public/pdf/source/20210922/C2856837_A0FF02895414764A7F2E525E58748FC4.pdf; Supplier: LCSC; Convert to PCB: yes; Contact Type: 双侧触点/上下接; Mounting Type: 卧贴; Height Above Board: 2mm; Operating Temperature Range: -25℃~+85℃; Name: FPC-05FB-40PH20
FPC2 = 3.2TFT_FPC-05FB-6PH20: Manufacturer: XUNPU(讯普); Add into BOM: yes; Locking Feature: 翻盖式; Number of Contacts: 6P; Pitch: 0.5mm; FFC, FCB Thickness: 0.3mm; Symbol: FPC-05FB-6PH20; Device: FPC-05FB-6PH20; LCSC Part Name: 间距:0.5mm P数:6P 翻盖式 双侧触点/上下接; Supplier Part: C2856827; Manufacturer Part: FPC-05FB-6PH20; Supplier Footprint: SMD,P=0.5mm,卧贴; JLCPCB Part Class: 扩展库; Datasheet: https://atta.szlcsc.com/upload/public/pdf/source/20210922/9700C5675183E5254BEFC967D607C435.pdf; Supplier: LCSC; Convert to PCB: yes; Contact Type: 双侧触点/上下接; Mounting Type: 卧贴; Height Above Board: 2mm; Operating Temperature Range: -25℃~+85℃; Name: FPC-05FB-6PH20
P55 = Header 2: Header, 2-Pin; LatestRevisionDate: 17-Jul-2002; LatestRevisionNote: Re-released for DXP Platform.; Publisher: Altium Limited
Q1 = PDTC123JE: Manufacturer: Prisemi(芯导); Add into BOM: yes; Symbol: PDTC123JE; Device: PDTC123JE; LCSC Part Name: PDTC123JE; Supplier Part: C5162511; Manufacturer Part: PDTC123JE; Supplier Footprint: SOT-523; JLCPCB Part Class: 扩展库; Datasheet: https://atta.szlcsc.com/upload/public/pdf/source/20220914/32F0D56C91C5C7C90374D12E52D8DD56.pdf; Supplier: LCSC; Convert to PCB: yes; Name: PDTC123JE
R21-R23 R91 R92 R99 = Res_0402: as R1 on sheet LED+KEY; Add into BOM: yes; Supplier Footprint: 0603
  R21-R23: Value: 39R; Name: 39R
  R91 R92 R99: Value: 100K; Name: 100K
R93-R98 = Res_0603: Symbol: 电阻; Convert to PCB: yes; Device: Res_0603; Add into BOM: yes; Supplier Footprint: 0603
  R93 R94: Value: 10K; Name: 10K
  R95-R98: Value: NC; Name: NC
RN1 RN2 = EXB2HV104JV: Manufacturer: PANASONIC(松下); Add into BOM: yes; Number of Resistors: 8; Tolerance: ±5%; Power(Watts): 63mW; Temperature Coefficient: ±200ppm/℃; Symbol: EXB2HV104JV; Device: EXB2HV104JV; LCSC Part Name: 100kΩ ±5%; Supplier Part: C713455; Manufacturer Part: EXB2HV104JV; Supplier Footprint: SMD-16P,1.6x3.8mm; JLCPCB Part Class: 扩展库; Datasheet: https://atta.szlcsc.com/upload/public/pdf/source/20200731/C713455_CE8DFF94E3BC43FC82AF683E1C1CBAC4.pdf; Supplier: LCSC; Convert to PCB: yes; Value: 100kΩ; Number of Pins: 16; Name: 100kΩ
TP1-TP16 = T1.0-SMD: PCB DECAL: PAD1.0_SMT

## Sheet BMP581.SchDoc
size A4; SheetNumber: 11; SheetTotal: 17
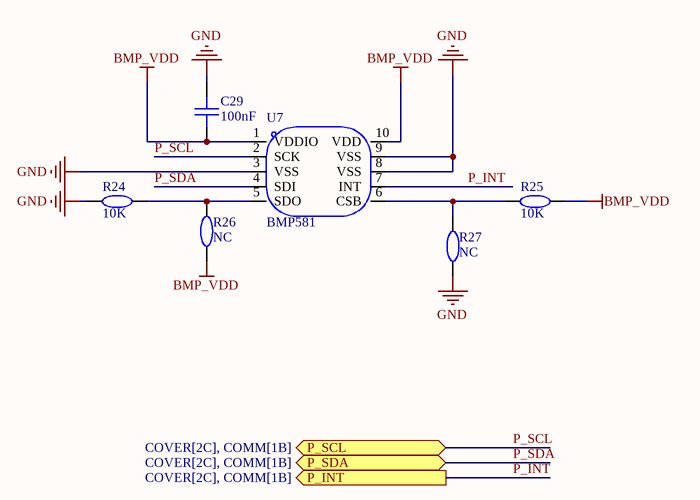
[diagram p11: BMP581.SchDoc]

### Parts
C29  100nF  [C0402]
R24  10K  [R0402]
R25  10K  [R0402]
R26  NC  [R0402]
R27  NC  [R0402]
U7  BMP581  [LGA-10_L2.0-W2.0-P0.50-TL_BMP581]

### Ports
P_INT (out, see COVER[2C], COMM[1B]), P_SCL (bidir, see COVER[2C], COMM[1B]), P_SDA (bidir, see COVER[2C], COMM[1B])

### Nets
BMP_VDD: C29.1 R25.2 R26.1 U7.1(VDDIO) U7.10(VDD)
GND: C29.2 R24.1 R27.1 U7.3(VSS) U7.8(VSS) U7.9(VSS)
P_INT: U7.7(INT) ; port P_INT
P_SCL: U7.2(SCK) ; port P_SCL
P_SDA: U7.4(SDI) ; port P_SDA
NetR24_2: R24.2 R26.2 U7.5(SDO)
NetR25_1: R25.1 R27.2 U7.6(CSB)

### Library data of the parts
C29 = CAP_0402: as C1 on sheet LED+KEY; Add into BOM: yes; Supplier Footprint: 0603; Value: 100nF; Name: 100nF
R24-R27 = Res_0402: as R1 on sheet LED+KEY; Add into BOM: yes; Supplier Footprint: 0603
  R24 R25: Value: 10K; Name: 10K
  R26 R27: Value: NC; Name: NC
U7 = BMP581: Manufacturer: Bosch(博世); Add into BOM: yes; Symbol: BMP581; Device: BMP581; LCSC Part Name: BMP581; Supplier Part: C5362283; Manufacturer Part: BMP581; Supplier Footprint: LGA-10(2x2); Datasheet: https://atta.szlcsc.com/upload/public/pdf/source/20230606/E1C2E9A0F840B280A91BB131B6D3944D.pdf; Supplier: LCSC; Convert to PCB: yes; Name: BMP581

## Sheet LSM6DS3TR-C.SchDoc
size A4; SheetNumber: 12; SheetTotal: 17
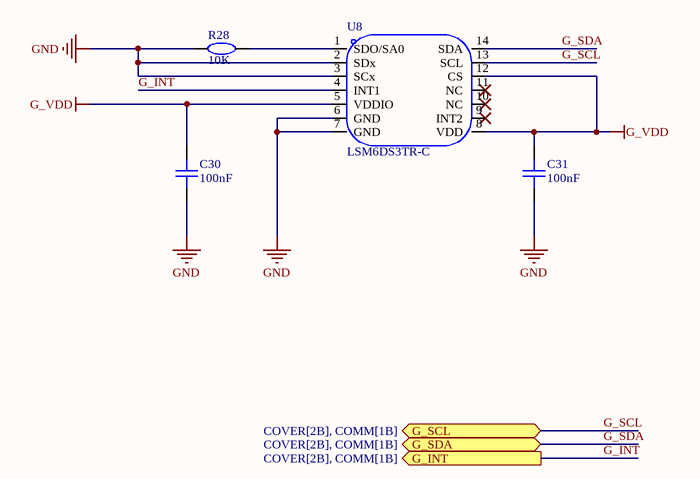
[diagram p12: LSM6DS3TR-C.SchDoc]

### Parts
C30  100nF  [C0402]
C31  100nF  [C0402]
R28  10K  [R0402]
U8  LSM6DS3TR-C  [LGA-14_L3.0-W2.5-P0.50-TL]

### Ports
G_INT (out, see COVER[2B], COMM[1B]), G_SCL (bidir, see COVER[2B], COMM[1B]), G_SDA (bidir, see COVER[2B], COMM[1B])

### Nets
G_VDD: C30.2 C31.2 U8.5(VDDIO) U8.8(VDD) U8.12(CS)
GND: C30.1 C31.1 R28.1 U8.2(SDx) U8.3(SCx) U8.6(GND) U8.7(GND)
G_INT: U8.4(INT1) ; port G_INT
G_SCL: U8.13(SCL) ; port G_SCL
G_SDA: U8.14(SDA) ; port G_SDA
NetR28_2: R28.2 U8.1(SDO/SA0)

Not connected (* = marked no-connect by the designer): U8 9(INT2)* 10(NC)* 11(NC)*

### Library data of the parts
C30 C31 = CAP_0402: as C1 on sheet LED+KEY; Add into BOM: yes; Supplier Footprint: 0603; Value: 100nF; Name: 100nF
R28 = Res_0402: as R1 on sheet LED+KEY; Add into BOM: yes; Supplier Footprint: 0603; Value: 10K; Name: 10K
U8 = LSM6DS3TR-C: Manufacturer: ST(意法半导体); Add into BOM: yes; Sensor Type: 加速度计陀螺仪; Symbol: LSM6DS3TR-C; Device: LSM6DS3TR-C; LCSC Part Name: IMU-惯性测量单元; Supplier Part: C967633; Manufacturer Part: LSM6DS3TR-C; Supplier Footprint: LGA-14(2.5x3); Datasheet: https://atta.szlcsc.com/upload/public/pdf/source/20210226/C967633_4D8B3A108D63359423D57B97CE5134B1.pdf; Supplier: LCSC; Convert to PCB: yes; Operating Temperature: -40℃~+85℃; Name: LSM6DS3TR-C

## Sheet SD3078.SchDoc
size A4; SheetNumber: 13; SheetTotal: 17
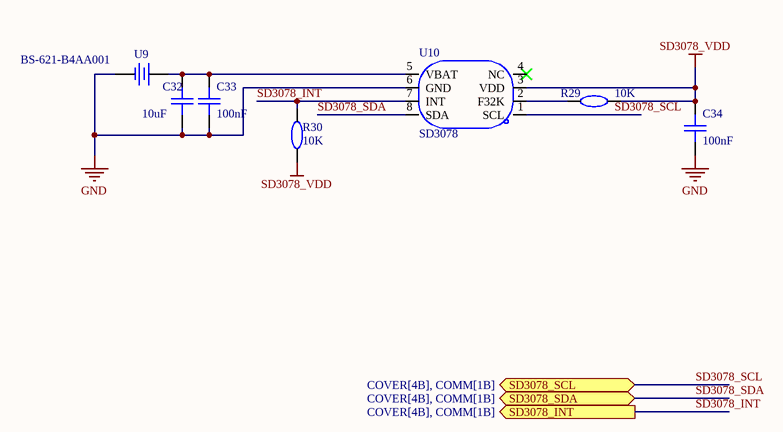
[diagram p13: SD3078.SchDoc]

### Parts
C32  10uF  [C0603]
C33  100nF  [C0402]
C34  100nF  [C0402]
R29  10K  [R0402]
R30  10K  [R0402]
U9  BS-621-B4AA001  [BAT-SMD_BS-621-B4AA001]
U10  SD3078  [SOP-8_L5.3-W5.2-P1.27-LS7.9-BL]

### Ports
SD3078_INT (out, see COVER[4B], COMM[1B]), SD3078_SCL (bidir, see COVER[4B], COMM[1B]), SD3078_SDA (bidir, see COVER[4B], COMM[1B])

### Nets
GND: C32.1 C33.1 C34.1 U9.1 U10.6(GND)
SD3078_VDD: C34.2 R29.2 R30.1 U10.3(VDD)
SD3078_INT: R30.2 U10.7(INT) ; port SD3078_INT
SD3078_SCL: U10.1(SCL) ; port SD3078_SCL
SD3078_SDA: U10.8(SDA) ; port SD3078_SDA
NetC32_2: C32.2 C33.2 U9.2 U10.5(VBAT)
NetR29_1: R29.1 U10.2(F32K)

Not connected (* = marked no-connect by the designer): U10 4(NC)*

### Library data of the parts
C32 = CAP_0603: Symbol: CapAcitance; Convert to PCB: yes; Device: CAP_0603; Add into BOM: yes; Supplier Footprint: 0603; Value: 10uF; Name: 10uF
C33 C34 = CAP_0402: as C1 on sheet LED+KEY; Add into BOM: yes; Supplier Footprint: 0603; Value: 100nF; Name: 100nF
R29 R30 = Res_0402: as R1 on sheet LED+KEY; Add into BOM: yes; Supplier Footprint: 0603; Value: 10K; Name: 10K
U9 = BS-621-B4AA001: Manufacturer: MYOUNG(美阳); Add into BOM: yes; Connector Type: 电池底座; Battery Type: CR621; Symbol: BS-621-B4AA001; Device: BS-621-B4AA001; LCSC Part Name: 电池底座 适用电池:CR621; Supplier Part: C7525440; Manufacturer Part: BS-621-B4AA001; Supplier Footprint: SMD; Datasheet: https://atta.szlcsc.com/upload/public/pdf/source/20230821/914923C1DE837EC779C4976F7575F8B8.pdf; Supplier: LCSC; Convert to PCB: yes; Contact Material: 磷青铜; Contact Plating: 金; Operating Temperature Range: -25℃~+85℃; Name: BS-621-B4AA001
U10 = SD3078: Manufacturer: WAVE(兴威帆电子); Add into BOM: yes; Interface: I2C; Operating Voltage: 2.7V~5.5V; crystal oscillator: 内置; Symbol: SD3078; Device: SD3078; LCSC Part Name: SD3078; Supplier Part: C916255; Manufacturer Part: SD3078; Supplier Footprint: SOP-8-208mil; Datasheet: https://atta.szlcsc.com/upload/public/pdf/source/20220531/5E01E4A08D81DAED8B92A927505F3549.pdf; Supplier: LCSC; Convert to PCB: yes; Supply Current: -; The alarm clock output: -; Operating Temperature: -40℃~+85℃; Name: SD3078

## Sheet RC522.SchDoc
size A3; SheetNumber: 15; SheetTotal: 17
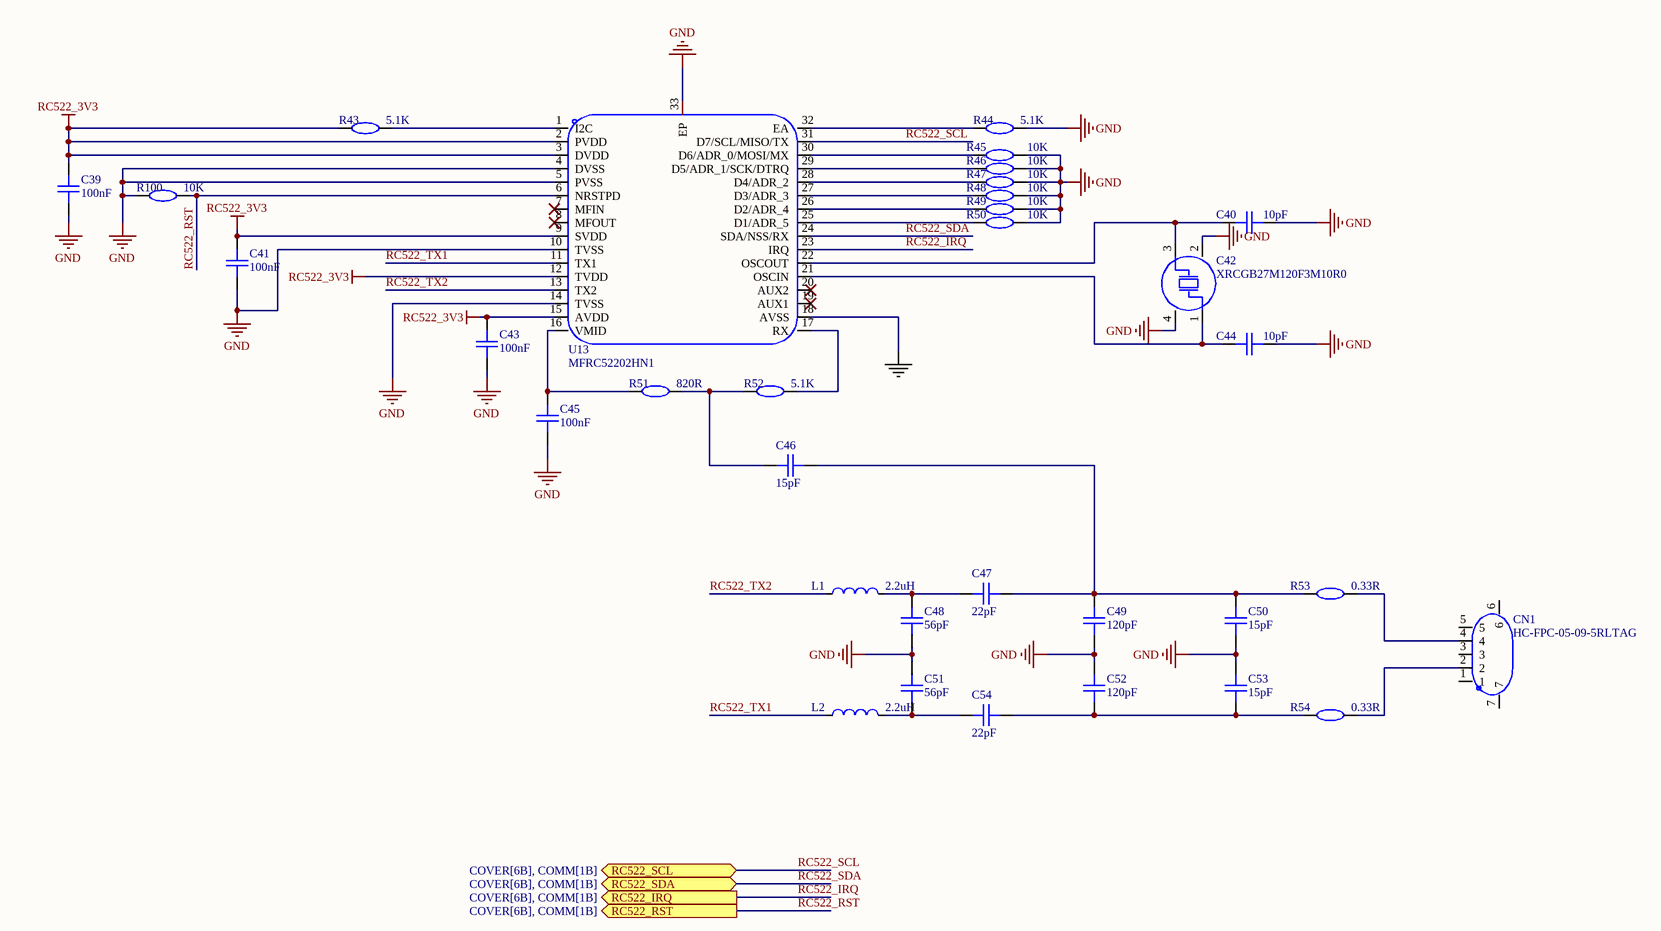
[diagram p14: RC522.SchDoc]

### Parts
C39  100nF  [C0402]
C40  10pF  [C0402]
C41  100nF  [C0402]
C42  XRCGB27M120F3M10R0  [CRYSTAL-SMD_4P-L2.0-W1.6-BL-B]
C43  100nF  [C0402]
C44  10pF  [C0402]
C45  100nF  [C0402]
C46  15pF  [C0402]
C47  22pF  [C0402]
C48  56pF  [C0402]
C49  120pF  [C0402]
C50  15pF  [C0402]
C51  56pF  [C0402]
C52  120pF  [C0402]
C53  15pF  [C0402]
C54  22pF  [C0402]
CN1  HC-FPC-05-09-5RLTAG  [CONN-SMD_5P-P0.50_HCTL_HC-FPC-05-09-5RLTAG]
L1  2.2uH  [L0603]
L2  2.2uH  [L0603]
R43  5.1K  [R0402]
R44  5.1K  [R0402]
R45  10K  [R0402]
R46  10K  [R0402]
R47  10K  [R0402]
R48  10K  [R0402]
R49  10K  [R0402]
R50  10K  [R0402]
R51  820R  [R0402]
R52  5.1K  [R0402]
R53  0.33R  [R0402]
R54  0.33R  [R0402]
R100  10K  [R0402]
U13  MFRC52202HN1  [HVQFN-32_L5.0-W5.0-P0.50-TL-EP3.1]

### Ports
RC522_IRQ (out, see COVER[6B], COMM[1B]), RC522_RST (out, see COVER[6B], COMM[1B]), RC522_SCL (bidir, see COVER[6B], COMM[1B]), RC522_SDA (bidir, see COVER[6B], COMM[1B])

### Nets
GND: C39.1 C40.1 C41.1 C42.2(GND) C42.4(GND) C43.1 C44.1 C45.1 C48.2 C49.1 C50.2 C51.1 C52.2 C53.1 R44.2 R45.2 R46.2 R47.2 R48.2 R49.2 R50.2 R100.1 U13.4(DVSS) U13.5(PVSS) U13.10(TVSS) U13.14(TVSS) U13.18(AVSS) U13.33(EP)
RC522_3V3: C39.2 C41.2 C43.2 R43.1 U13.2(PVDD) U13.3(DVDD) U13.9(SVDD) U13.12(TVDD) U13.15(AVDD)
RC522_IRQ: U13.23(IRQ) ; port RC522_IRQ
RC522_RST: R100.2 U13.6(NRSTPD) ; port RC522_RST
RC522_SCL: U13.31(D7/SCL/MISO/TX) ; port RC522_SCL
RC522_SDA: U13.24(SDA/NSS/RX) ; port RC522_SDA
RC522_TX1: L2.1 U13.11(TX1)
RC522_TX2: L1.1 U13.13(TX2)
NetC40_2: C40.2 C42.3(OSC2) U13.22(OSCOUT)
NetC42_1: C42.1(OSC1) C44.2 U13.21(OSCIN)
NetC45_2: C45.2 R51.1 U13.16(VMID)
NetC46_1: C46.1 C47.2 C49.2 C50.1 R53.1
NetC46_2: C46.2 R51.2 R52.1
NetC47_1: C47.1 C48.1 L1.2
NetC51_2: C51.2 C54.1 L2.2
NetC52_1: C52.1 C53.2 C54.2 R54.1
NetCN1_2: CN1.2 R54.2
NetCN1_4: CN1.4 R53.2
NetR43_2: R43.2 U13.1(I2C)
NetR44_1: R44.1 U13.32(EA)
NetR45_1: R45.1 U13.30(D6/ADR_0/MOSI/MX)
NetR46_1: R46.1 U13.29(D5/ADR_1/SCK/DTRQ)
NetR47_1: R47.1 U13.28(D4/ADR_2)
NetR48_1: R48.1 U13.27(D3/ADR_3)
NetR49_1: R49.1 U13.26(D2/ADR_4)
NetR50_1: R50.1 U13.25(D1/ADR_5)
NetR52_2: R52.2 U13.17(RX)

Not connected (* = marked no-connect by the designer): CN1 1 3 5 6 7; U13 7(MFIN)* 8(MFOUT)* 19(AUX1)* 20(AUX2)*

### Library data of the parts
C39-C41 C43-C54 = CAP_0402: as C1 on sheet LED+KEY; Add into BOM: yes; Supplier Footprint: 0603
  C39 C41 C43 C45: Value: 100nF; Name: 100nF
  C40 C44: Value: 10pF; Name: 10pF
  C46 C50 C53: Value: 15pF; Name: 15pF
  C47 C54: Value: 22pF; Name: 22pF
  C48 C51: Value: 56pF; Name: 56pF
  C49 C52: Value: 120pF; Name: 120pF
C42 = XRCGB27M120F3M10R0: Add into BOM: yes; Symbol: XRCGB27M120F3M10R0; Device: XRCGB27M120F3M10R0; LCSC Part Name: XRCGB27M120F3M10R0; Supplier Part: C9900017793; Manufacturer Part: XRCGB27M120F3M10R0; Supplier Footprint: SMD-4_2016; JLCPCB Part Class: 扩展库; Supplier: LCSC; Convert to PCB: yes; Name: XRCGB27M120F3M10R0
CN1 = HC-FPC-05-09-5RLTAG: Manufacturer: HCTL(华灿天禄); Add into BOM: yes; Locking Feature: 翻盖式; Number of Contacts: 5P; Pitch: 0.5mm; FFC, FCB Thickness: 0.3mm; Symbol: HC-FPC-05-09-5RLTAG; Device: HC-FPC-05-09-5RLTAG; LCSC Part Name: 翻盖式 双侧触点/上下接 P数:5P 间距:0.5mm; Supplier Part: C5213747; Manufacturer Part: HC-FPC-05-09-5RLTAG; Supplier Footprint: SMD,P=0.5mm,卧贴; JLCPCB Part Class: 扩展库; Datasheet: https://atta.szlcsc.com/upload/public/pdf/source/20221026/52A26161A88FCE07A06989F8D4399614.pdf; Supplier: LCSC; Convert to PCB: yes; Contact Type: 双侧触点/上下接; Mounting Type: 卧贴; Height Above Board: 1mm; Contact Material: 铜合金; Operating Temperature Range: -55℃~+85℃; Name: HC-FPC-05-09-5RLTAG
L1 L2 = L_0603: Symbol: SDFL1608S100KTF; Add into BOM: yes; Device: L_0603; Supplier Footprint: L0603; Convert to PCB: yes; Value: 2.2uH; Name: 2.2uH
R43-R54 R100 = Res_0402: as R1 on sheet LED+KEY; Add into BOM: yes; Supplier Footprint: 0603
  R43 R44 R52: Value: 5.1K; Name: 5.1K
  R45-R50 R100: Value: 10K; Name: 10K
  R51: Value: 820R; Name: 820R
  R53 R54: Value: 0.33R; Name: 0.33R
U13 = MFRC52202HN1: Manufacturer: NXP(恩智浦); Add into BOM: yes; Symbol: MFRC52202HN1; Device: MFRC52202HN1; LCSC Part Name: MFRC52202HN1; Supplier Part: C843830; Manufacturer Part: MFRC52202HN1; Supplier Footprint: HVQFN-32-EP(5x5); JLCPCB Part Class: 扩展库; Datasheet: https://atta.szlcsc.com/upload/public/pdf/source/20210612/7E057865B518E13EE9A01435AD863201.pdf; Supplier: LCSC; Convert to PCB: yes; Name: MFRC52202HN1

## Sheet COMM.SchDoc
size A3; SheetNumber: 16; SheetTotal: 17
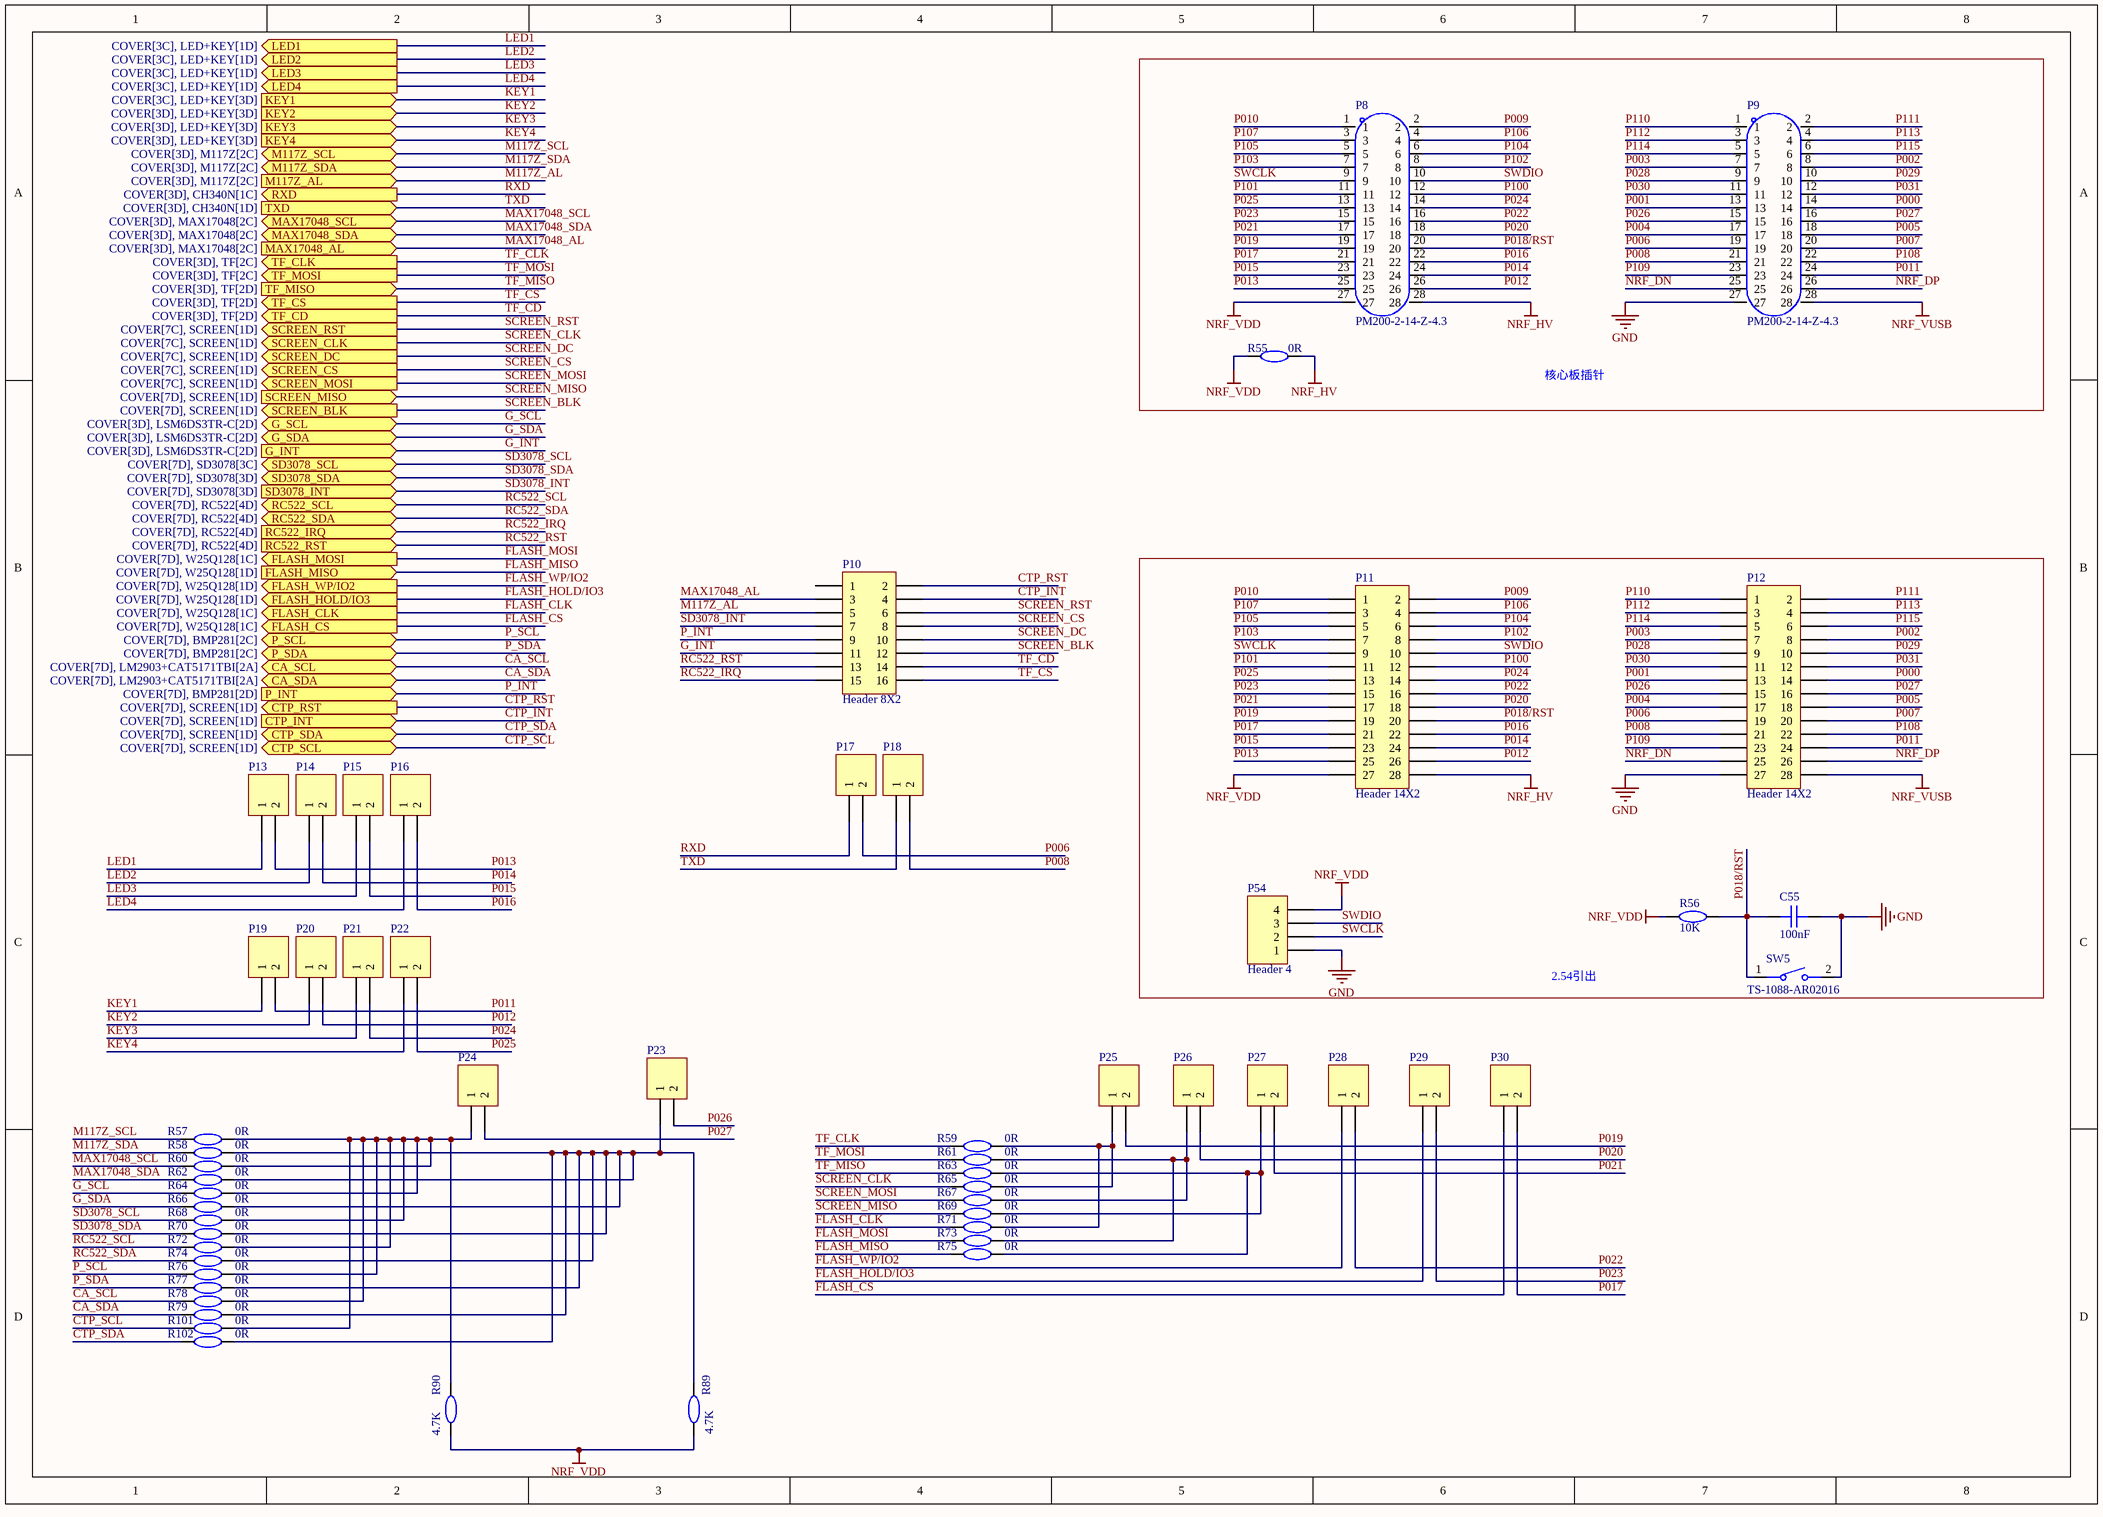
[diagram p15: COMM.SchDoc]

### Parts
C55  100nF  [C0402]
P8  PM200-2-14-Z-4.3  [HDR-TH_28P-P2.00-V-F-R2-C14-S2.00_MF200V-12-28-0590]
P9  PM200-2-14-Z-4.3  [HDR-TH_28P-P2.00-V-F-R2-C14-S2.00_MF200V-12-28-0590]
P10  Header 8X2  [HDR2X8]
P11  Header 14X2  [HDR2X14]
P12  Header 14X2  [HDR2X14]
P13  Header 2  [HDR1X2]  (value not drawn)
P14  Header 2  [HDR1X2]  (value not drawn)
P15  Header 2  [HDR1X2]  (value not drawn)
P16  Header 2  [HDR1X2]  (value not drawn)
P17  Header 2  [HDR1X2]  (value not drawn)
P18  Header 2  [HDR1X2]  (value not drawn)
P19  Header 2  [HDR1X2]  (value not drawn)
P20  Header 2  [HDR1X2]  (value not drawn)
P21  Header 2  [HDR1X2]  (value not drawn)
P22  Header 2  [HDR1X2]  (value not drawn)
P23  Header 2  [HDR1X2]  (value not drawn)
P24  Header 2  [HDR1X2]  (value not drawn)
P25  Header 2  [HDR1X2]  (value not drawn)
P26  Header 2  [HDR1X2]  (value not drawn)
P27  Header 2  [HDR1X2]  (value not drawn)
P28  Header 2  [HDR1X2]  (value not drawn)
P29  Header 2  [HDR1X2]  (value not drawn)
P30  Header 2  [HDR1X2]  (value not drawn)
P54  Header 4  [HDR1X4]
R55  0R  [R0402]
R56  10K  [R0402]
R57  0R  [R0402]
R58  0R  [R0402]
R59  0R  [R0402]
R60  0R  [R0402]
R61  0R  [R0402]
R62  0R  [R0402]
R63  0R  [R0402]
R64  0R  [R0402]
R65  0R  [R0402]
R66  0R  [R0402]
R67  0R  [R0402]
R68  0R  [R0402]
R69  0R  [R0402]
R70  0R  [R0402]
R71  0R  [R0402]
R72  0R  [R0402]
R73  0R  [R0402]
R74  0R  [R0402]
R75  0R  [R0402]
R76  0R  [R0402]
R77  0R  [R0402]
R78  0R  [R0402]
R79  0R  [R0402]
R89  4.7K  [R0402]
R90  4.7K  [R0402]
R101  0R  [R0402]
R102  0R  [R0402]
SW5  TS-1088-AR02016  [SW-SMD_L3.9-W3.0-P4.45]

### Blocks framed on the sheet
核心板插针: P8 P9 R55
2.54引出: C55 P11 P12 P54 R56 SW5

### Ports
CA_SCL (bidir, see COVER[7D], LM2903+CAT5171TBI[2A]), CA_SDA (bidir, see COVER[7D], LM2903+CAT5171TBI[2A]), CTP_INT (in, see COVER[7D], SCREEN[1D]), CTP_RST (out, see COVER[7D], SCREEN[1D]), CTP_SCL (bidir, see COVER[7D], SCREEN[1D]), CTP_SDA (bidir, see COVER[7D], SCREEN[1D]), FLASH_CLK (out, see COVER[7D], W25Q128[1C]), FLASH_CS (out, see COVER[7D], W25Q128[1C]), FLASH_HOLD/IO3 (out, see COVER[7D], W25Q128[1D]), FLASH_MISO (in, see COVER[7D], W25Q128[1D]), FLASH_MOSI (out, see COVER[7D], W25Q128[1C]), FLASH_WP/IO2 (out, see COVER[7D], W25Q128[1D]), G_INT (in, see COVER[3D], LSM6DS3TR-C[2D]), G_SCL (bidir, see COVER[3D], LSM6DS3TR-C[2D]), G_SDA (bidir, see COVER[3D], LSM6DS3TR-C[2D]), KEY1 (in, see COVER[3C], LED+KEY[3D]), KEY2 (in, see COVER[3D], LED+KEY[3D]), KEY3 (in, see COVER[3D], LED+KEY[3D]), KEY4 (in, see COVER[3D], LED+KEY[3D]), LED1 (out, see COVER[3C], LED+KEY[1D]), LED2 (out, see COVER[3C], LED+KEY[1D]), LED3 (out, see COVER[3C], LED+KEY[1D]), LED4 (out, see COVER[3C], LED+KEY[1D]), M117Z_AL (in, see COVER[3D], M117Z[2C]), M117Z_SCL (bidir, see COVER[3D], M117Z[2C]), M117Z_SDA (bidir, see COVER[3D], M117Z[2C]), MAX17048_AL (in, see COVER[3D], MAX17048[2C]), MAX17048_SCL (bidir, see COVER[3D], MAX17048[2C]), MAX17048_SDA (bidir, see COVER[3D], MAX17048[2C]), P_INT (in, see COVER[7D], BMP281[2D]), P_SCL (bidir, see COVER[7D], BMP281[2C]), P_SDA (bidir, see COVER[7D], BMP281[2C]), RC522_IRQ (in, see COVER[7D], RC522[4D]), RC522_RST (in, see COVER[7D], RC522[4D]), RC522_SCL (bidir, see COVER[7D], RC522[4D]), RC522_SDA (bidir, see COVER[7D], RC522[4D]), RXD (out, see COVER[3D], CH340N[1C]), SCREEN_BLK (out, see COVER[7D], SCREEN[1D]), SCREEN_CLK (out, see COVER[7C], SCREEN[1D]), SCREEN_CS (out, see COVER[7C], SCREEN[1D]), SCREEN_DC (out, see COVER[7C], SCREEN[1D]), SCREEN_MISO (in, see COVER[7D], SCREEN[1D]), SCREEN_MOSI (out, see COVER[7C], SCREEN[1D]), SCREEN_RST (out, see COVER[7C], SCREEN[1D]), SD3078_INT (in, see COVER[7D], SD3078[3D]), SD3078_SCL (bidir, see COVER[7D], SD3078[3C]), SD3078_SDA (bidir, see COVER[7D], SD3078[3D]), TF_CD (out, see COVER[3D], TF[2D]), TF_CLK (out, see COVER[3D], TF[2C]), TF_CS (out, see COVER[3D], TF[2D]), TF_MISO (in, see COVER[3D], TF[2D]), TF_MOSI (out, see COVER[3D], TF[2C]), TXD (in, see COVER[3D], CH340N[1D])

### Nets
GND: C55.2 P9.27 P12.27 P54.1 SW5.2
NRF_HV: P8.28 P11.28 R55.2
NRF_VDD: P8.27 P11.27 P54.4 R55.1 R56.1 R89.1 R90.1
NRF_VUSB: P9.28 P12.28
CA_SCL: R78.1 ; port CA_SCL
CA_SDA: R79.1 ; port CA_SDA
CTP_INT: P10.4 ; port CTP_INT
CTP_RST: P10.2 ; port CTP_RST
CTP_SCL: R101.1 ; port CTP_SCL
CTP_SDA: R102.1 ; port CTP_SDA
FLASH_CLK: R71.1 ; port FLASH_CLK
FLASH_CS: P30.1 ; port FLASH_CS
FLASH_HOLD/IO3: P29.1 ; port FLASH_HOLD/IO3
FLASH_MISO: R75.1 ; port FLASH_MISO
FLASH_MOSI: R73.1 ; port FLASH_MOSI
FLASH_WP/IO2: P28.1 ; port FLASH_WP/IO2
G_INT: P10.11 ; port G_INT
G_SCL: R64.1 ; port G_SCL
G_SDA: R66.1 ; port G_SDA
KEY1: P19.1 ; port KEY1
KEY2: P20.1 ; port KEY2
KEY3: P21.1 ; port KEY3
KEY4: P22.1 ; port KEY4
LED1: P13.1 ; port LED1
LED2: P14.1 ; port LED2
LED3: P15.1 ; port LED3
LED4: P16.1 ; port LED4
M117Z_AL: P10.5 ; port M117Z_AL
M117Z_SCL: R57.1 ; port M117Z_SCL
M117Z_SDA: R58.1 ; port M117Z_SDA
MAX17048_AL: P10.3 ; port MAX17048_AL
MAX17048_SCL: R60.1 ; port MAX17048_SCL
MAX17048_SDA: R62.1 ; port MAX17048_SDA
NRF_DN: P9.25 P12.25
NRF_DP: P9.26 P12.26
P000: P9.14 P12.14
P001: P9.13 P12.13
P002: P9.8 P12.8
P003: P9.7 P12.7
P004: P9.17 P12.17
P005: P9.18 P12.18
P006: P9.19 P12.19 P17.2
P007: P9.20 P12.20
P008: P9.21 P12.21 P18.2
P009: P8.2 P11.2
P010: P8.1 P11.1
P011: P9.24 P12.24 P19.2
P012: P8.26 P11.26 P20.2
P013: P8.25 P11.25 P13.2
P014: P8.24 P11.24 P14.2
P015: P8.23 P11.23 P15.2
P016: P8.22 P11.22 P16.2
P017: P8.21 P11.21 P30.2
P018/RST: C55.1 P8.20 P11.20 R56.2 SW5.1
P019: P8.19 P11.19 P25.2
P020: P8.18 P11.18 P26.2
P021: P8.17 P11.17 P27.2
P022: P8.16 P11.16 P28.2
P023: P8.15 P11.15 P29.2
P024: P8.14 P11.14 P21.2
P025: P8.13 P11.13 P22.2
P026: P9.15 P12.15 P23.2
P027: P9.16 P12.16 P24.2
P028: P9.9 P12.9
P029: P9.10 P12.10
P030: P9.11 P12.11
P031: P9.12 P12.12
P100: P8.12 P11.12
P101: P8.11 P11.11
P102: P8.8 P11.8
P103: P8.7 P11.7
P104: P8.6 P11.6
P105: P8.5 P11.5
P106: P8.4 P11.4
P107: P8.3 P11.3
P108: P9.22 P12.22
P109: P9.23 P12.23
P110: P9.1 P12.1
P111: P9.2 P12.2
P112: P9.3 P12.3
P113: P9.4 P12.4
P114: P9.5 P12.5
P115: P9.6 P12.6
P_INT: P10.9 ; port P_INT
P_SCL: R76.1 ; port P_SCL
P_SDA: R77.1 ; port P_SDA
RC522_IRQ: P10.15 ; port RC522_IRQ
RC522_RST: P10.13 ; port RC522_RST
RC522_SCL: R72.1 ; port RC522_SCL
RC522_SDA: R74.1 ; port RC522_SDA
RXD: P17.1 ; port RXD
SCREEN_BLK: P10.12 ; port SCREEN_BLK
SCREEN_CLK: R65.1 ; port SCREEN_CLK
SCREEN_CS: P10.8 ; port SCREEN_CS
SCREEN_DC: P10.10 ; port SCREEN_DC
SCREEN_MISO: R69.1 ; port SCREEN_MISO
SCREEN_MOSI: R67.1 ; port SCREEN_MOSI
SCREEN_RST: P10.6 ; port SCREEN_RST
SD3078_INT: P10.7 ; port SD3078_INT
SD3078_SCL: R68.1 ; port SD3078_SCL
SD3078_SDA: R70.1 ; port SD3078_SDA
SWCLK: P8.9 P11.9 P54.2
SWDIO: P8.10 P11.10 P54.3
TF_CD: P10.14 ; port TF_CD
TF_CLK: R59.1 ; port TF_CLK
TF_CS: P10.16 ; port TF_CS
TF_MISO: R63.1 ; port TF_MISO
TF_MOSI: R61.1 ; port TF_MOSI
TXD: P18.1 ; port TXD
NetP23_1: P23.1 R58.2 R62.2 R66.2 R70.2 R74.2 R77.2 R79.2 R89.2 R102.2
NetP24_1: P24.1 R57.2 R60.2 R64.2 R68.2 R72.2 R76.2 R78.2 R90.2 R101.2
NetP25_1: P25.1 R59.2 R65.2 R71.2
NetP26_1: P26.1 R61.2 R67.2 R73.2
NetP27_1: P27.1 R63.2 R69.2 R75.2

Not connected (* = marked no-connect by the designer): P10 1

### Library data of the parts
C55 = CAP_0402: as C1 on sheet LED+KEY; Add into BOM: yes; Supplier Footprint: 0603; Value: 100nF; Name: 100nF
P8 P9 = PM200-2-14-Z-4.3_C3012178: Manufacturer: HCTL(华灿天禄); Add into BOM: yes; Holes Structure: 2x14P; Pitch: 2mm; Circular Hole / Square Hole: 方孔; Number of Holes: 28P; Current Rating (Max): 1.5A; Holes Direction: 顶部; Symbol: PM200-2-14-Z-4.3_C3012178; Device: PM200-2-14-Z-4.3_C3012178; LCSC Part Name: 2x14P 间距:2mm 直插; Supplier Part: C3012178; Manufacturer Part: PM200-2-14-Z-4.3; Supplier Footprint: 插件,P=2mm; JLCPCB Part Class: 扩展库; Datasheet: https://atta.szlcsc.com/upload/public/pdf/source/20230609/7782803E9FC77B1812B983B108C615C3.pdf; Supplier: LCSC; Convert to PCB: yes; Row Spacing: 2mm; Mounting Type: 直插; Number of Rows: 双排; Insulation Height: 4.3mm; Contact Material: 黄铜; Operating Temperature Range: -40℃~+105℃; Name: PM200-2-14-Z-4.3
P10 = Header 8X2: Header, 8-Pin, Dual row; LatestRevisionDate: 17-Jul-2002; LatestRevisionNote: Re-released for DXP Platform.; Publisher: Altium Limited
P11 P12 = Header 14X2: Header, 14-Pin, Dual row; LatestRevisionDate: 17-Jul-2002; LatestRevisionNote: Re-released for DXP Platform.; Publisher: Altium Limited
P13-P30 = Header 2: Header, 2-Pin; LatestRevisionDate: 17-Jul-2002; LatestRevisionNote: Re-released for DXP Platform.; Publisher: Altium Limited
P54 = Header 4: Header, 4-Pin; LatestRevisionDate: 17-Jul-2002; LatestRevisionNote: Re-released for DXP Platform.; Publisher: Altium Limited
R55-R79 R89 R90 R101 R102 = Res_0402: as R1 on sheet LED+KEY; Add into BOM: yes; Supplier Footprint: 0603
  R55 R57-R79 R101 R102: Value: 0R; Name: 0R
  R56: Value: 10K; Name: 10K
  R89 R90: Value: 4.7K; Name: 4.7K
SW5 = TS-1088-AR02016: as SW1 on sheet LED+KEY; Symbol: TS-1088-AR02016; Device: TS-1088-AR02016; LCSC Part Name: 4*3*2mm 立贴 轻触开关; Supplier Part: C720477; Manufacturer Part: TS-1088-AR02016; Supplier Footprint: SMD; Datasheet: https://atta.szlcsc.com/upload/public/pdf/source/20200810/C720475_60D09DD6C54279ADDB2DC25100F1CC11.pdf; Supplier: LCSC; Convert to PCB: yes; Mounting Style: 立贴; Operating Temperature: -30℃~+80℃; Name: TS-1088-AR02016